# Altium project GEN3_FanCtrl_PROD_V03.PrjPcb (part 2 of 3)

## Sheet MCU.SchDoc
size A2; SheetNumber: 3; SheetTotal: 9; SPICEModelCacheXJMQHWHR: <root> / <DocumentId>XJMQHWHR</DocumentId> / </root>
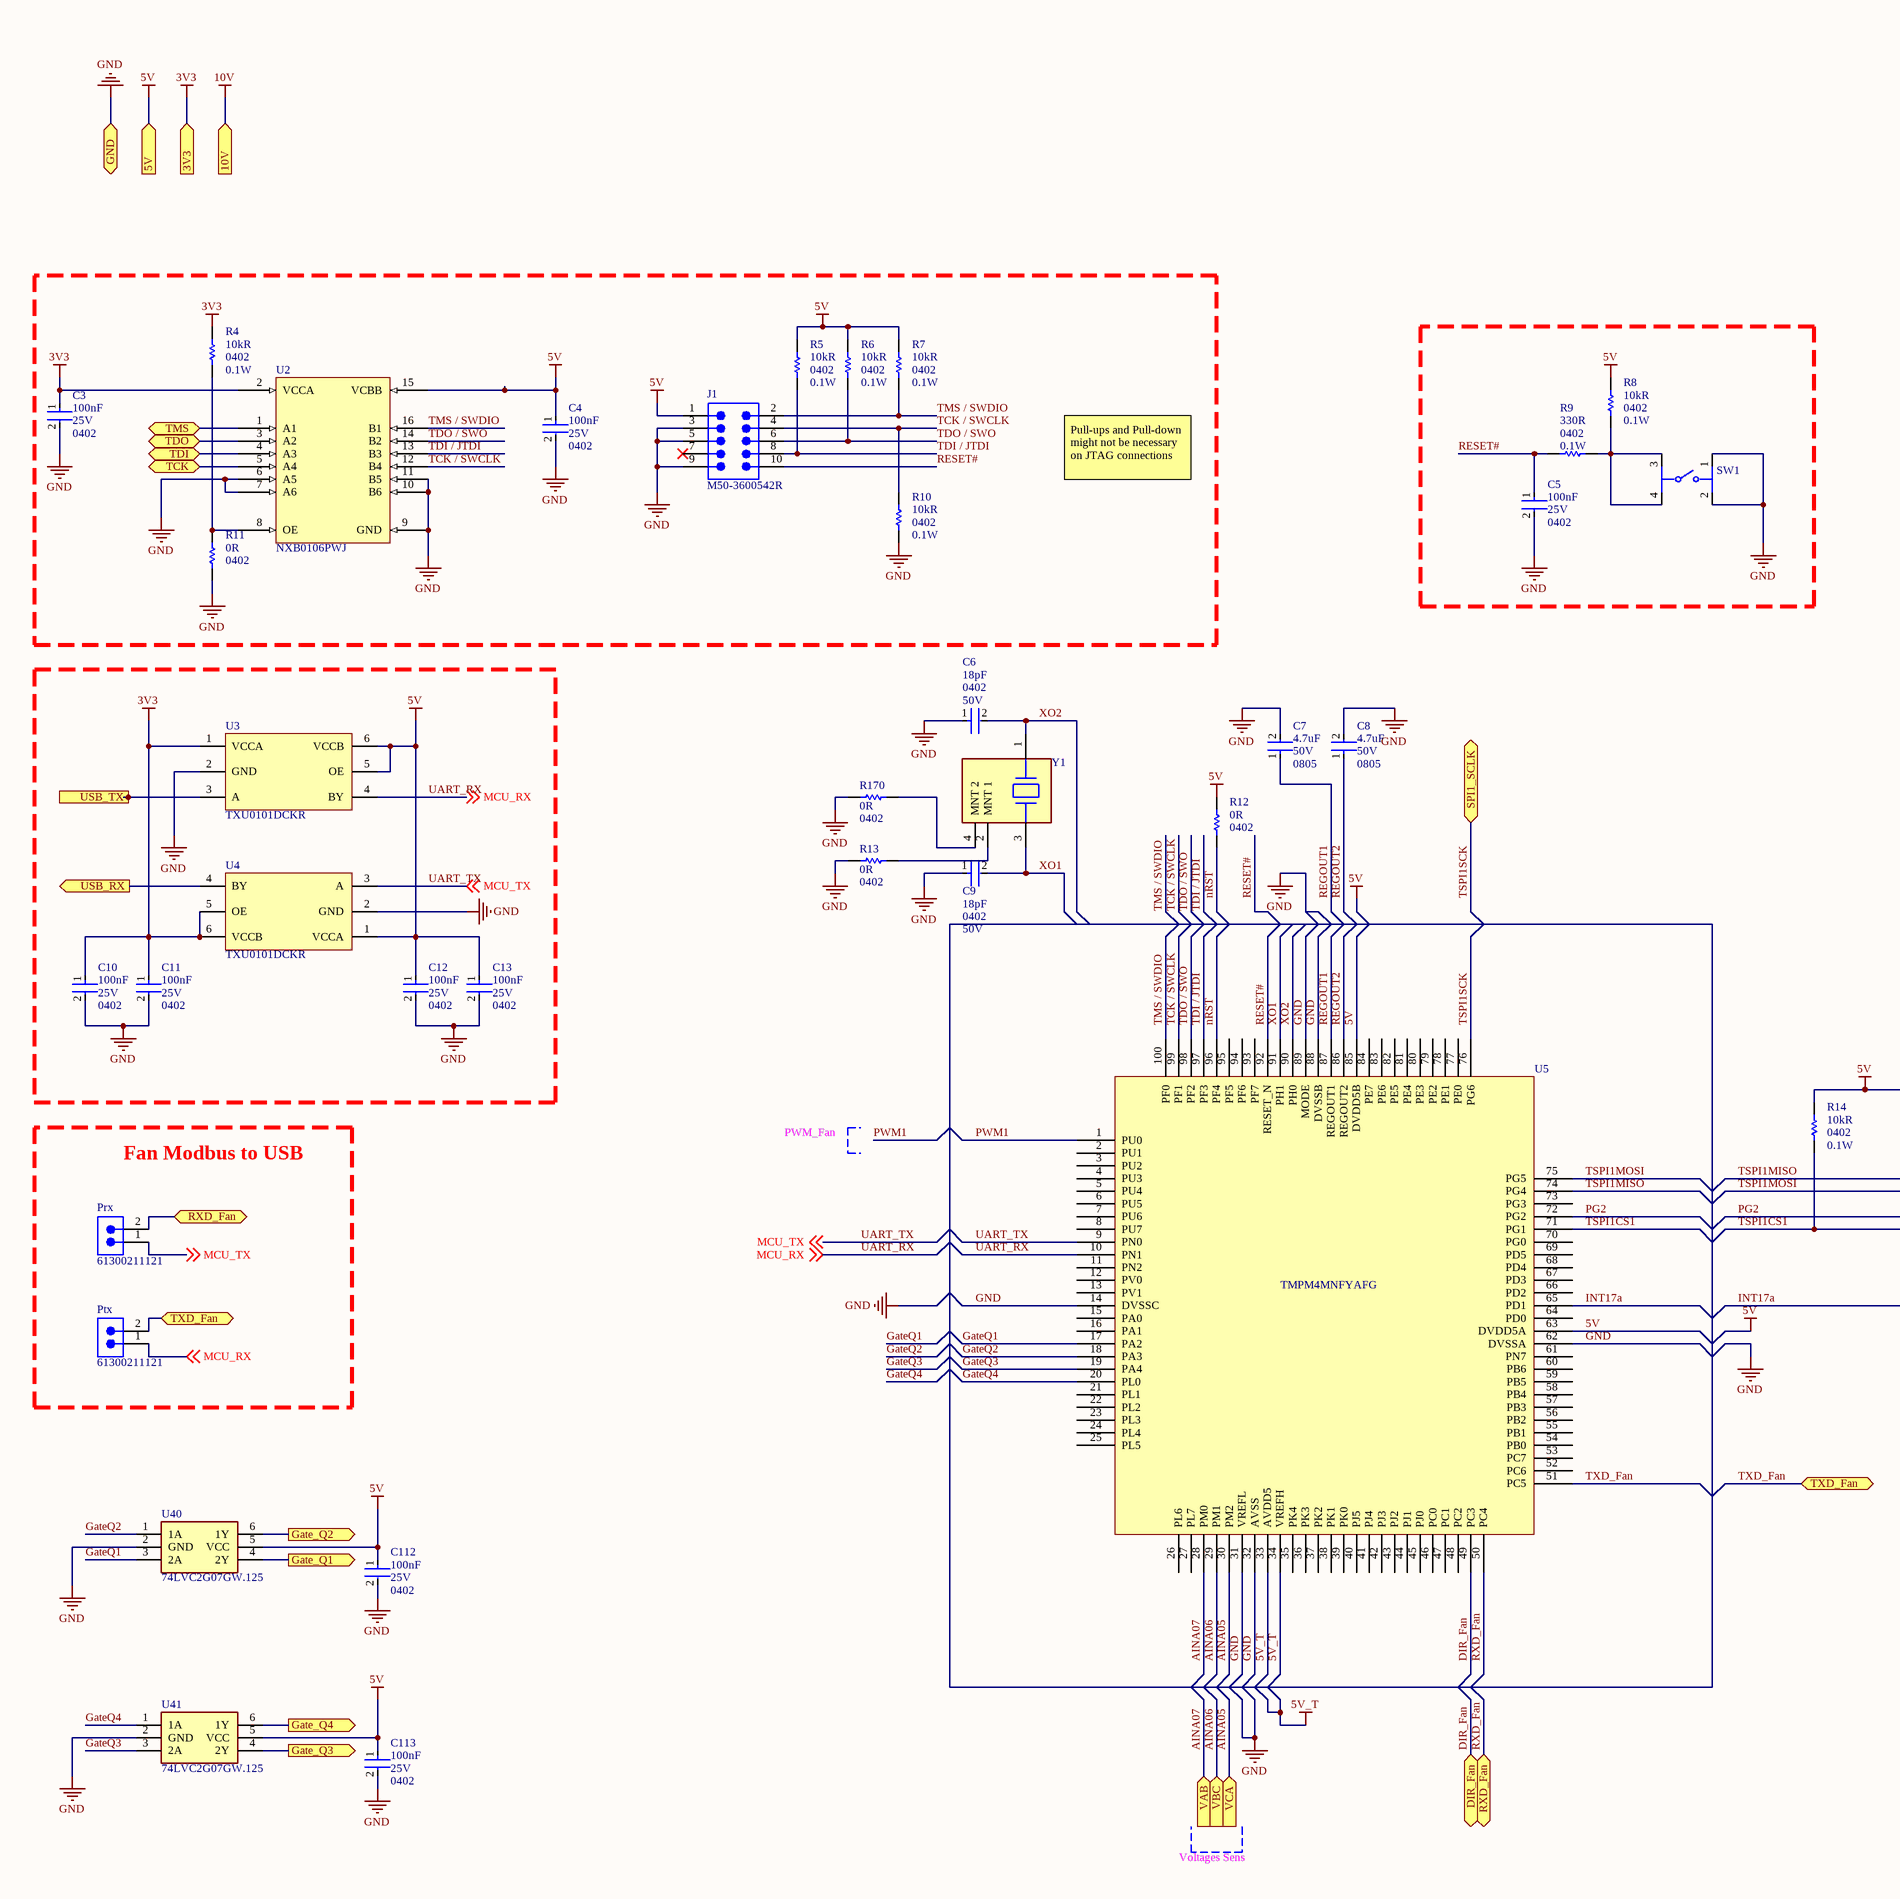
[diagram p5: MCU.SchDoc, left]
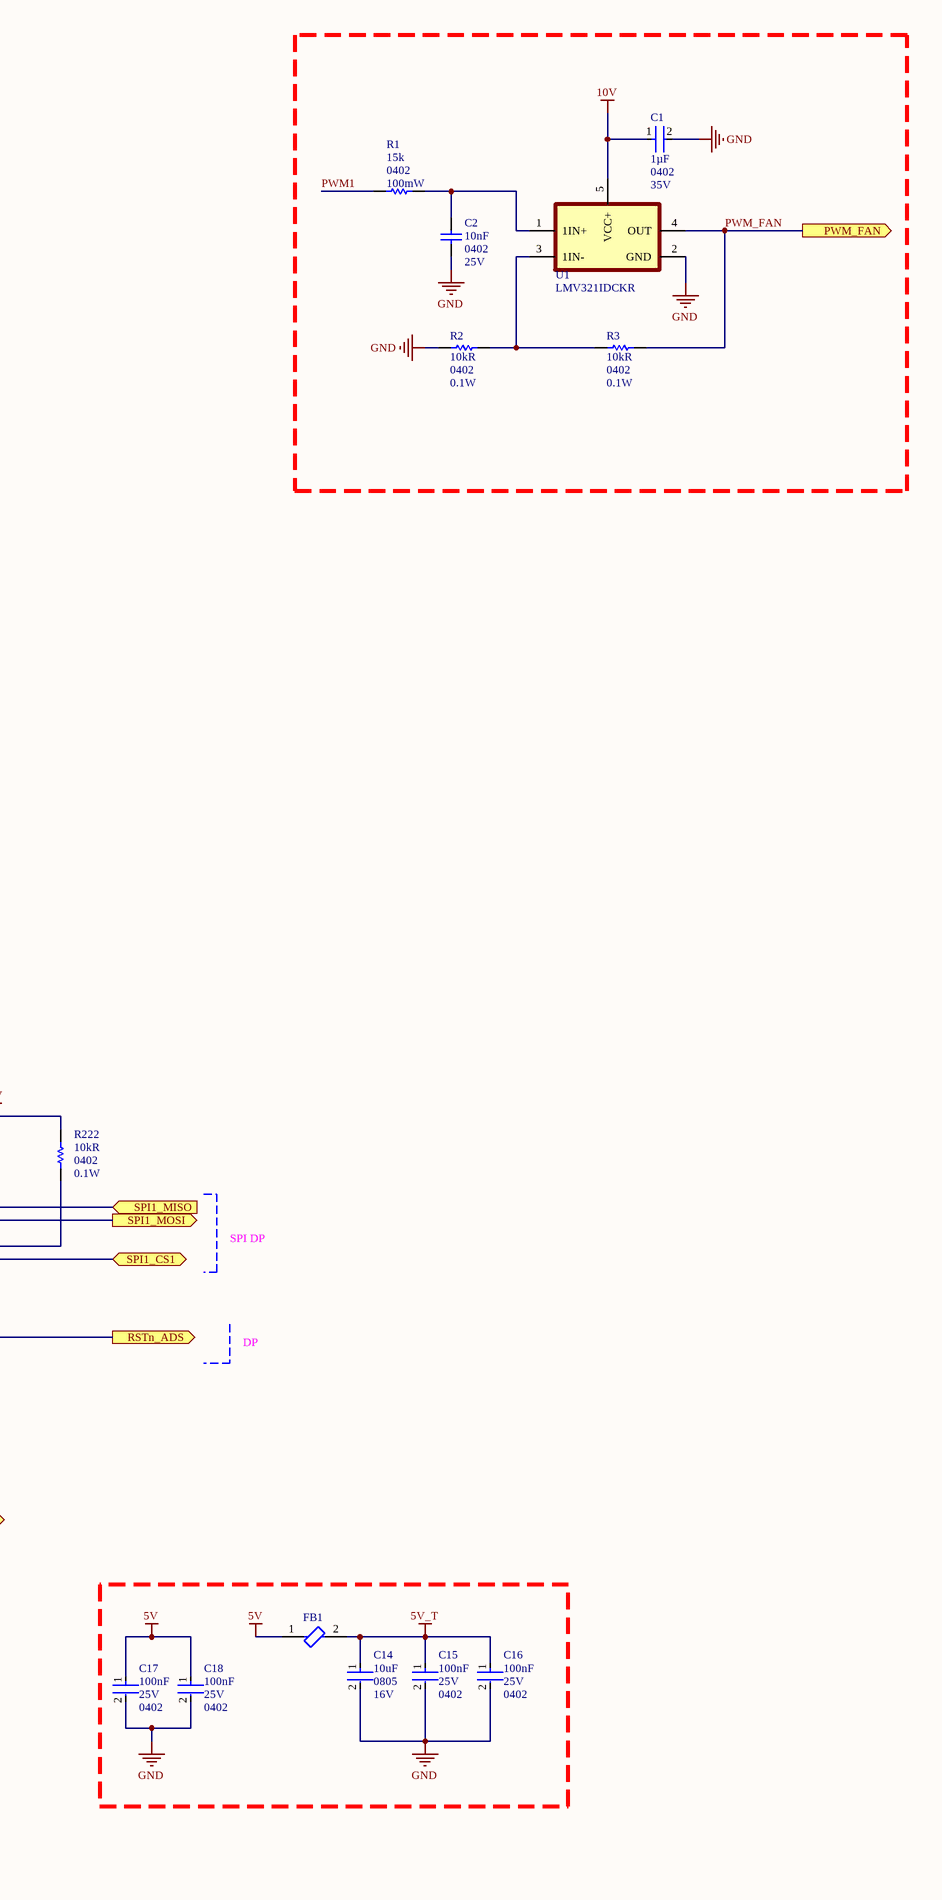
[diagram p6: MCU.SchDoc, right]

### Parts
C1  value 1µF  Case/Package: 0402  Voltage Rating: 35V  [FP-C1005-050-0_05-IPC_A]  (hidden comment: C1005JB1V105K050BC)
C2  value 10nF  Package: 0402  Parameter 1: 25V  [CAPC1005X55X25ML05T10]  (hidden comment: GRM155R71E103KA01D)
C3  value 100nF  Voltage Rating: 25V  Case/Package: 0402  [FP-CL830-IPC_A]  (hidden comment: CL05B104KA5NNNC)
C4  value 100nF  Voltage Rating: 25V  Case/Package: 0402  [FP-CL830-IPC_A]  (hidden comment: CL05B104KA5NNNC)
C5  value 100nF  Voltage Rating: 25V  Case/Package: 0402  [FP-CL830-IPC_A]  (hidden comment: CL05B104KA5NNNC)
C6  value 18pF  Case/Package: 0402  Voltage Rating: 50V  [FP-GJM155-0_05-IPC_A]  (hidden comment: GJM1555C1H180GB01D)
C7  Case/Package: 0805  Capacitance: 4.7uF  Voltage Rating: 50V  [FP-GRM21B-0_15-IPC_B]  (hidden comment: GRM21BR61H475KE51L)
C8  Case/Package: 0805  Capacitance: 4.7uF  Voltage Rating: 50V  [FP-GRM21B-0_15-IPC_B]  (hidden comment: GRM21BR61H475KE51L)
C9  value 18pF  Case/Package: 0402  Voltage Rating: 50V  [FP-GJM155-0_05-IPC_A]  (hidden comment: GJM1555C1H180GB01D)
C10  value 100nF  Voltage Rating: 25V  Case/Package: 0402  [FP-CL830-IPC_A]  (hidden comment: CL05B104KA5NNNC)
C11  value 100nF  Voltage Rating: 25V  Case/Package: 0402  [FP-CL830-IPC_A]  (hidden comment: CL05B104KA5NNNC)
C12  value 100nF  Voltage Rating: 25V  Case/Package: 0402  [FP-CL830-IPC_A]  (hidden comment: CL05B104KA5NNNC)
C13  value 100nF  Voltage Rating: 25V  Case/Package: 0402  [FP-CL830-IPC_A]  (hidden comment: CL05B104KA5NNNC)
C14  Case Code (Imperial): 0805  Voltage Rating: 16V  Capacitance: 10uF  [FP-GRM21B-0_1-MFG]  (hidden comment: GRM21BR61C106KE15K)
C15  value 100nF  Voltage Rating: 25V  Case/Package: 0402  [FP-CL830-IPC_A]  (hidden comment: CL05B104KA5NNNC)
C16  value 100nF  Voltage Rating: 25V  Case/Package: 0402  [FP-CL830-IPC_A]  (hidden comment: CL05B104KA5NNNC)
C17  value 100nF  Voltage Rating: 25V  Case/Package: 0402  [FP-CL830-IPC_A]  (hidden comment: CL05B104KA5NNNC)
C18  value 100nF  Voltage Rating: 25V  Case/Package: 0402  [FP-CL830-IPC_A]  (hidden comment: CL05B104KA5NNNC)
C112  value 100nF  Voltage Rating: 25V  Case/Package: 0402  [FP-CL830-IPC_A]  (hidden comment: CL05B104KA5NNNC)
C113  value 100nF  Voltage Rating: 25V  Case/Package: 0402  [FP-CL830-IPC_A]  (hidden comment: CL05B104KA5NNNC)
FB1  MPZ2012S221AT000  [FP-MPZ2012-MFG]  (value not drawn)
J1  M50-3600542R  [FP-M50-3600542R-MFG]
Prx  61300211121  [61300211121]
Ptx  61300211121  [61300211121]
R1  value 15k  Case/Package: 0402  Power: 100mW  [RESC1005X40X25LL10T10]  (hidden comment: RK73H1ETTP1502F)
R2  value 10kR  Package: 0402  Power: 0.1W  [RESC1005X40X25LL10T10]  (hidden comment: RK73H1ETTP1002F)
R3  value 10kR  Package: 0402  Power: 0.1W  [RESC1005X40X25LL10T10]  (hidden comment: RK73H1ETTP1002F)
R4  value 10kR  Package: 0402  Power Rating: 0.1W  [RESC1005X40X25LL10T10]  (hidden comment: RK73H1ETTP1002F)
R5  value 10kR  Package: 0402  Power Rating: 0.1W  [RESC1005X40X25LL10T10]  (hidden comment: RK73H1ETTP1002F)
R6  value 10kR  Package: 0402  Power Rating: 0.1W  [RESC1005X40X25LL10T10]  (hidden comment: RK73H1ETTP1002F)
R7  value 10kR  Package: 0402  Power Rating: 0.1W  [RESC1005X40X25LL10T10]  (hidden comment: RK73H1ETTP1002F)
R8  value 10kR  Package: 0402  Power Rating: 0.1W  [RESC1005X40X25LL10T10]  (hidden comment: RK73H1ETTP1002F)
R9  value 330R  Package: 0402  Power Rating: 0.1W  [RESC1005X40X25LL10T10]  (hidden comment: RK73H1ETTP3300F)
R10  value 10kR  Package: 0402  Power Rating: 0.1W  [RESC1005X40X25LL10T10]  (hidden comment: RK73H1ETTP1002F)
R11  value 0R  Package: 0402  [FP-RK73Z1E-IPC_B]  (hidden comment: RK73Z1ETTP)
R12  value 0R  Package: 0402  [FP-RK73Z1E-IPC_B]  (hidden comment: RK73Z1ETTP)
R13  value 0R  Package: 0402  [FP-RK73Z1E-IPC_B]  (hidden comment: RK73Z1ETTP)
R14  value 10kR  Package: 0402  Power Rating: 0.1W  [RESC1005X40X25LL10T10]  (hidden comment: RK73H1ETTP1002F)
R170  value 0R  Package: 0402  [FP-RK73Z1E-IPC_B]  (hidden comment: RK73Z1ETTP)
R222  value 10kR  Package: 0402  Power Rating: 0.1W  [RESC1005X40X25LL10T10]  (hidden comment: RK73H1ETTP1002F)
SW1  PTS810SJM250SMTRLFS  [FP-PTS810SJM250SMTRLFS-MFG]  (value not drawn)
U1  LMV321IDCKR  [LMV321IDCKR-Footprint-1]
U2  NXB0106PWJ  [TSOP65P640X120-16N]
U3  TXU0101DCKR  [FP-DCK0006A-MFG]
U4  TXU0101DCKR  [FP-DCK0006A-MFG]
U5  TMPM4MNFYAFG  [TSQFP50P1600X1600X145-100N]  (value not drawn)
U40  74LVC2G07GW.125  [74LVC2G07GW.125-Footprint-1]
U41  74LVC2G07GW.125  [74LVC2G07GW.125-Footprint-1]
Y1  ABM10-166-12.000MHZ-T3  [FP-ABM10-166-167-MFG]  (value not drawn)

### Blocks framed on the sheet
Fan Modbus to USB: Prx Ptx

### Ports
3V3 (in), 5V (in), 10V (in), DIR_Fan (bidir), Gate_Q1 (out), Gate_Q2 (out), Gate_Q3 (out), Gate_Q4 (out), GND (bidir), PWM_FAN (out), RSTn_ADS (out), RXD_Fan (bidir), SPI1_CS1 (bidir), SPI1_MISO (in), SPI1_MOSI (out), SPI1_SCLK (bidir), TCK (bidir), TDI (bidir), TDO (bidir), TMS (bidir), TXD_Fan (bidir), USB_RX (out), USB_TX (in), VAB (in), VBC (in), VCA (in)

### Nets
3V3: C3.1 C10.1 C11.1 R4.2 U2.2(VCCA) U3.1(VCCA) U4.5(OE) U4.6(VCCB) ; port 3V3
5V: C4.1 C12.1 C13.1 C17.1 C18.1 C112.1 C113.1 FB1.1 J1.1 R5.2 R6.2 R7.2 R8.2 R12.2 R14.2 R222.2 U2.15(VCBB) U3.5(OE) U3.6(VCCB) U4.1(VCCA) U5.63(DVDD5A) U5.85(DVDD5B) U40.5(VCC) U41.5(VCC) ; port 5V
5V_T: C14.1 C15.1 C16.1 FB1.2 U5.33(AVDD5) U5.34(VREFH)
10V: C1.1 U1.5(VCC+) ; port 10V
GND: C1.2 C2.1 C3.2 C4.2 C5.2 C6.1 C7.2 C8.2 C9.1 C10.2 C11.2 C12.2 C13.2 C14.2 C15.2 C16.2 C17.2 C18.2 C112.2 C113.2 J1.3 J1.5 J1.9 R2.1 R10.1 R11.1 R13.2 R170.2 SW1.1 SW1.2 U1.2(GND) U2.6(A5) U2.7(A6) U2.9(GND) U2.10(B6) U2.11(B5) U3.2(GND) U4.2(GND) U5.14(DVSSC) U5.31(VREFL) U5.32(AVSS) U5.62(DVSSA) U5.88(DVSSB) U5.89(MODE) U40.2(GND) U41.2(GND) ; port GND
AINA05: U5.30(PM2) ; port VCA
AINA06: U5.29(PM1) ; port VBC
AINA07: U5.28(PM0) ; port VAB
DIR_Fan: U5.49(PC3) ; port DIR_Fan
Gate_Q1: U40.4(2Y) ; port Gate_Q1
Gate_Q2: U40.6(1Y) ; port Gate_Q2
Gate_Q3: U41.4(2Y) ; port Gate_Q3
Gate_Q4: U41.6(1Y) ; port Gate_Q4
GateQ1: U5.17(PA2) U40.3(2A)
GateQ2: U5.18(PA3) U40.1(1A)
GateQ3: U5.19(PA4) U41.3(2A)
GateQ4: U5.20(PL0) U41.1(1A)
INT17a: U5.65(PD1) ; port RSTn_ADS
nRST: R12.1 U5.96(PF4)
PG2: R222.1 U5.72(PG2)
PWM1: R1.1 U5.1(PU0)
PWM_FAN: R3.2 U1.4(OUT) ; port PWM_FAN
REGOUT1: C7.1 U5.87(REGOUT1)
REGOUT2: C8.1 U5.86(REGOUT2)
RESET#: C5.1 J1.10 R9.1 U5.92(RESET_N)
RXD_Fan: Prx.2 U5.50(PC4) ; port RXD_Fan
TCK: U2.5(A4) ; port TCK
TCK / SWCLK: J1.4 R10.2 U2.12(B4) U5.99(PF1)
TDI: U2.4(A3) ; port TDI
TDI / JTDI: J1.8 R5.1 U2.13(B3) U5.97(PF3)
TDO: U2.3(A2) ; port TDO
TDO / SWO: J1.6 R6.1 U2.14(B2) U5.98(PF2)
TMS: U2.1(A1) ; port TMS
TMS / SWDIO: J1.2 R7.1 U2.16(B1) U5.100(PF0)
TSPI1CS1: R14.1 U5.71(PG1) ; port SPI1_CS1  [project net ~{C}S]
TSPI1MISO: U5.74(PG4) ; port SPI1_MISO  [project net MISO]
TSPI1MOSI: U5.75(PG5) ; port SPI1_MOSI  [project net MOSI]
TSPI1SCK: U5.76(PG6) ; port SPI1_SCLK  [project net SCLK]
TXD_Fan: Ptx.2 U5.51(PC5) ; port TXD_Fan
UART_RX: Ptx.1 U3.4(BY) U5.10(PN1) ; off-sheet MCU_RX  [also labelled MCU_RX]
UART_TX: Prx.1 U4.3(A) U5.9(PN0) ; off-sheet MCU_TX  [also labelled MCU_TX]
USB_RX: U4.4(BY) ; port USB_RX
USB_TX: U3.3(A) ; port USB_TX
XO1: C9.2 U5.91(PH1) Y1.3
XO2: C6.2 U5.90(PH0) Y1.1
NetC2_2: C2.2 R1.2 U1.1(1IN+)
NetR2_2: R2.2 R3.1 U1.3(1IN-)
NetR4_1: R4.1 R11.2 U2.8(OE)
NetR8_1: R8.1 R9.2 SW1.3 SW1.4
NetR13_1: R13.1 Y1.2(MNT_1)
NetR170_1: R170.1 Y1.4(MNT_2)

Not connected (* = marked no-connect by the designer): J1 7*; U5 2(PU1) 3(PU2) 4(PU3) 5(PU4) 6(PU5) 7(PU6) 8(PU7) 11(PN2) 12(PV0) 13(PV1) 15(PA0) 16(PA1) 21(PL1) 22(PL2) 23(PL3) 24(PL4) 25(PL5) 26(PL6) 27(PL7) 35(PK4) 36(PK3) 37(PK2) 38(PK1) 39(PK0) 40(PJ5) 41(PJ4) 42(PJ3) 43(PJ2) 44(PJ1) 45(PJ0) 46(PC0) 47(PC1) 48(PC2) 52(PC6) 53(PC7) 54(PB0) 55(PB1) 56(PB2) 57(PB3) 58(PB4) 59(PB5) 60(PB6) 61(PN7) 64(PD0) 66(PD2) 67(PD3) 68(PD4) 69(PD5) 70(PG0) 73(PG3) 77(PE0) 78(PE1) 79(PE2) 80(PE3) 81(PE4) 82(PE5) 83(PE6) 84(PE7) 93(PF7) 94(PF6) 95(PF5)

### Notes on the sheet
- Pull-ups and Pull-down might not be necessary on JTAG connections
- PWM_Fan
- SPI DP
- DP
- Voltages Sens
- Title:
- Date:
- Drawn By:
- File:
- Time:
- Checked By:
- Sheet
- of

### Library data of the parts
C1 = CMP-001-00329-1: Ceramic Capacitor, Multilayer, Ceramic, 35V, 10% +Tol, 10% -Tol, JB, 10% TC, 1uF, Surface Mount, 0402; Capacitor Type: Ceramic; Min Operating Temperature: -25°C; RoHS Compliant: Yes; Max Operating Temperature: 85°C; Pins: 2; Mounting Technology: Surface Mount
C2 = CMP-x00072-1: Ceramic Capacitor, Multilayer, Ceramic, 25V, 10% +Tol, 10% -Tol, X7R, 15% TC, 0.01uF, Surface Mount, 0402; Manufacturer: Murata; Template: MR_0402; Vendor: TTI; Reel Width: 8mm; Mounting: SMT; MOQ: 10000; Category: Capacitor; Price: 0.00352
C3-C5 C10-C13 C15-C18 C112 C113 = CMP-001-00333-1: Ceramic Capacitor, Multilayer, Ceramic, 25V, 10% +Tol, 10% -Tol, X7R, 15% TC, 0.1uF, Surface Mount, 0402; Max Operating Temperature: 125°C; RoHS Compliant: Yes; Capacitor Type: Ceramic; Min Operating Temperature: -55°C; Pins: 2; Mounting Technology: Surface Mount
C6 C9 = CMP-001-00347-1: Ceramic Capacitor, Multilayer, Ceramic, 50V, 2% +Tol, 2% -Tol, C0G, 30ppm/Cel TC, 0.000018uF, Surface Mount, 0402; Max Operating Temperature: 125°C; RoHS Compliant: Yes; Pins: 2; Capacitor Type: Ceramic; Min Operating Temperature: -55°C; Mounting Technology: Surface Mount
C7 C8 = CMP-06035-059131-1: Chip Multilayer Ceramic Capacitors for General Purpose, 0805, 4.7uF, X5R, 15%, 10%, 50V; Case Code (Metric): 2012; Height: 1.25mm; Width: 0.049inch; Packaging: Tape and Reel; Mount: Surface Mount; REACH SVHC: No SVHC; Case Code (Imperial): 0805; Dielectric: X5R; Thickness: 0.055inch; Material: Ceramic; Depth: 1.25mm; Min Operating Temperature: -55°C; Lead Free: Lead Free; Max Operating Temperature: 85°C; Tolerance: 10%; Length: 2mm; Voltage Rating (DC): 50V
C14 = CMP-2007-03534-2: Chip Multilayer Ceramic Capacitors for General Purpose, 0805, 10uF, X5R, 15%, 10%, 16V; Packaging: Tape and Reel; Width: 0.049inch; Depth: 1.25mm; Height: 1.25mm; Case/Package: 0805; Max Operating Temperature: 85°C; Min Operating Temperature: -55°C; Tolerance: 10%; Dielectric: X5R; REACH SVHC: No SVHC; Mount: Surface Mount; Radiation Hardening: No; Case Code (Metric): 2012; Length: 2mm; Package Quantity: 10000; Voltage Rating (DC): 16V; Voltage: 16V; Thickness: 0.053inch; Termination: SMD/SMT
FB1 = CMP-08257-000020-1: FERRITE BEAD 220 OHM 0805 1LN; Test Frequency: 100MHz; Max DC Current: 3A; Tolerance: 25%; Impedance: 220R; DC Resistance (DCR): 40mR; Case/Package: 0805; Mount: Surface Mount; Termination: SMD/SMT; Packaging: Tape and Reel; Core Material: Ferrite; Case Code (Metric): 2012; Length: 0.079inch; Width: 0.049inch; Case Code (Imperial): 0805; REACH SVHC: No SVHC; Weight: 0.000194oz; Current Rating: 3A; Min Operating Temperature: -55°C; Lead Free: Lead Free; Package Quantity: 4000; Max Operating Temperature: 125°C; RoHS Compliant: Yes; Depth: 1.25mm; Height: 0.85mm
J1 = CMP-002-00657-2: Board Connector, 10 Contact(s), 2 Row(s), Female, Straight, 0.05 inch Pitch, Surface Mount Terminal, Locking, Black Insulator, Socket; Rating: 1A; Vendor: TTI; Reel Size: 16mm; MOQ: 800; Price Floor Quantity: 8000; Max Operating Temperature: 105°C; Mounting: SMT; Min Operating Temperature: -40°C; Source: Components - 07.02.25 - 13.24.SchLib; Mounting Technology: Board; Connector Type: BOARD CONNECTOR; RoHS Compliant: Yes; Price Floor: 0.75; Design Item ID: CMP-00130-1; Price @ MOQ: 0.86; Category: Connector; Case/Package: [5 x 2] 1.27mm
Prx Ptx = CMP-002-00257-1: WR-PHD Pin Header, THT, Vertical, pitch 2.54mm, 1 Row, 2P; Manufacturer: Wurth Elektronik; Contact Resistance: 20mOhm; Working Voltage: 250V; Rated Current: 3A; Withstanding Voltage: 500V; Match Code: WR-PHD; Packaging: Bag; ComponentLink2Description: Datasheet Link; Source: WR-PHD.SchLib; Operating Temperature Max: 105°C; Pin Count: 2; Orientation: Vertical; Gender: Pin Header; Pitch: 2.54mm; Manufacturer Part Number: 61300211121; Mount: Through Hole; ComponentLink1Description: Website Link; ComponentLink2URL: https://www.we-online.com/redexpert/spec/61300211121?ad; Pins: 2; ComponentLink1URL: https://www.we-online.com/redexpert/article/61300211121?ad; Design Item ID: 61300211121; Category: Board-to-Board Connectors; Number of Rows: 1; Component Type: Standard; Operating Temperature Min: -40°C
R1 = CMP-009-01023-1: Fixed Resistor, Metal Glaze/thick Film, 0.1W, 15000ohm, 75V, 1% +/-Tol, 100ppm/Cel, Surface Mount, 0402; Max Operating Temperature: 155°C; Tolerance: 1%; Min Operating Temperature: -55°C; Pins: 2; RoHS Compliant: Yes; Mounting Technology: Surface Mount
R2-R8 R10 R14 R222 = CMP-x00150-2: Fixed Resistor, Metal Glaze/thick Film, 0.1W, 10000ohm, 75V, 1% +/-Tol, 100ppm/Cel, Surface Mount, 0402; Template: KS_0402_R
R9 = CMP-x00168-1: Fixed Resistor, Metal Glaze/thick Film, 0.1W, 330ohm, 75V, 1% +/-Tol, 100ppm/Cel, Surface Mount, 0402
R11-R13 R170 = CMP-x00147-2: Metal Glaze/thick Film, 0ohm, Surface Mount, 0402; Template: KS_0402_R
  R11 R12: Power Rating: *
SW1 = CMP-x00082-1: Keypad Switch, 1 Switches, SPST, Momentary-tactile, 0.05A, 16VDC, 1.57N, Solder Terminal, Surface Mount-straight; Manufacturer: C&K; Reel Width: 12mm; Vendor: TTI; Category: Switches; MOQ: 2900; Mounting: SMT; Package: SPST; Price: 0.233; Template: -; Value: -
U1 = CMP-014-00033-1: Operational Amplifier, 1 Func, 7000uV Offset-Max, BIPolar, PDSO5; Channels: 1; Nominal Supply Voltage: 2.7V; Pins: 5; RoHS Compliant: Yes; Min Operating Temperature: -40°C; Case/Package: TSSOP; Max Operating Temperature: 125°C
U2 = CMP-x00220-1: NXB0106 - Dual supply translating transceiver; auto direction sensing; 3-state
U3 U4 = CMP-x00221-3: Single channel fixed-direction level shifter 6-SC70 -40 to 125
U5 = CMP-001-0044-8: Toshiba Micro
U40 U41 = CMP-00122-1: Buffer, Non-Inverting 2 Element 1 Bit per Element Open Drain Output 6-TSSOP
Y1 = CMP-003-00032-4: Crystal 12MHz ±10ppm (Tol) ±10ppm (Stability) 8pF FUND 125Ohm 4-Pin SMD T/R; Manufacturer: TI; Vendor: TTI; Reel Size: 8mm; Template: TI_4_SMD; Category: Crystal; Price: 0.207; Rating: 8pF; MOQ: 3000; Value: 12MHz; Package: 4-SMD; Mounting Technology: SMT

## Sheet USB.SchDoc
size A3; SheetNumber: 2; SheetTotal: 9
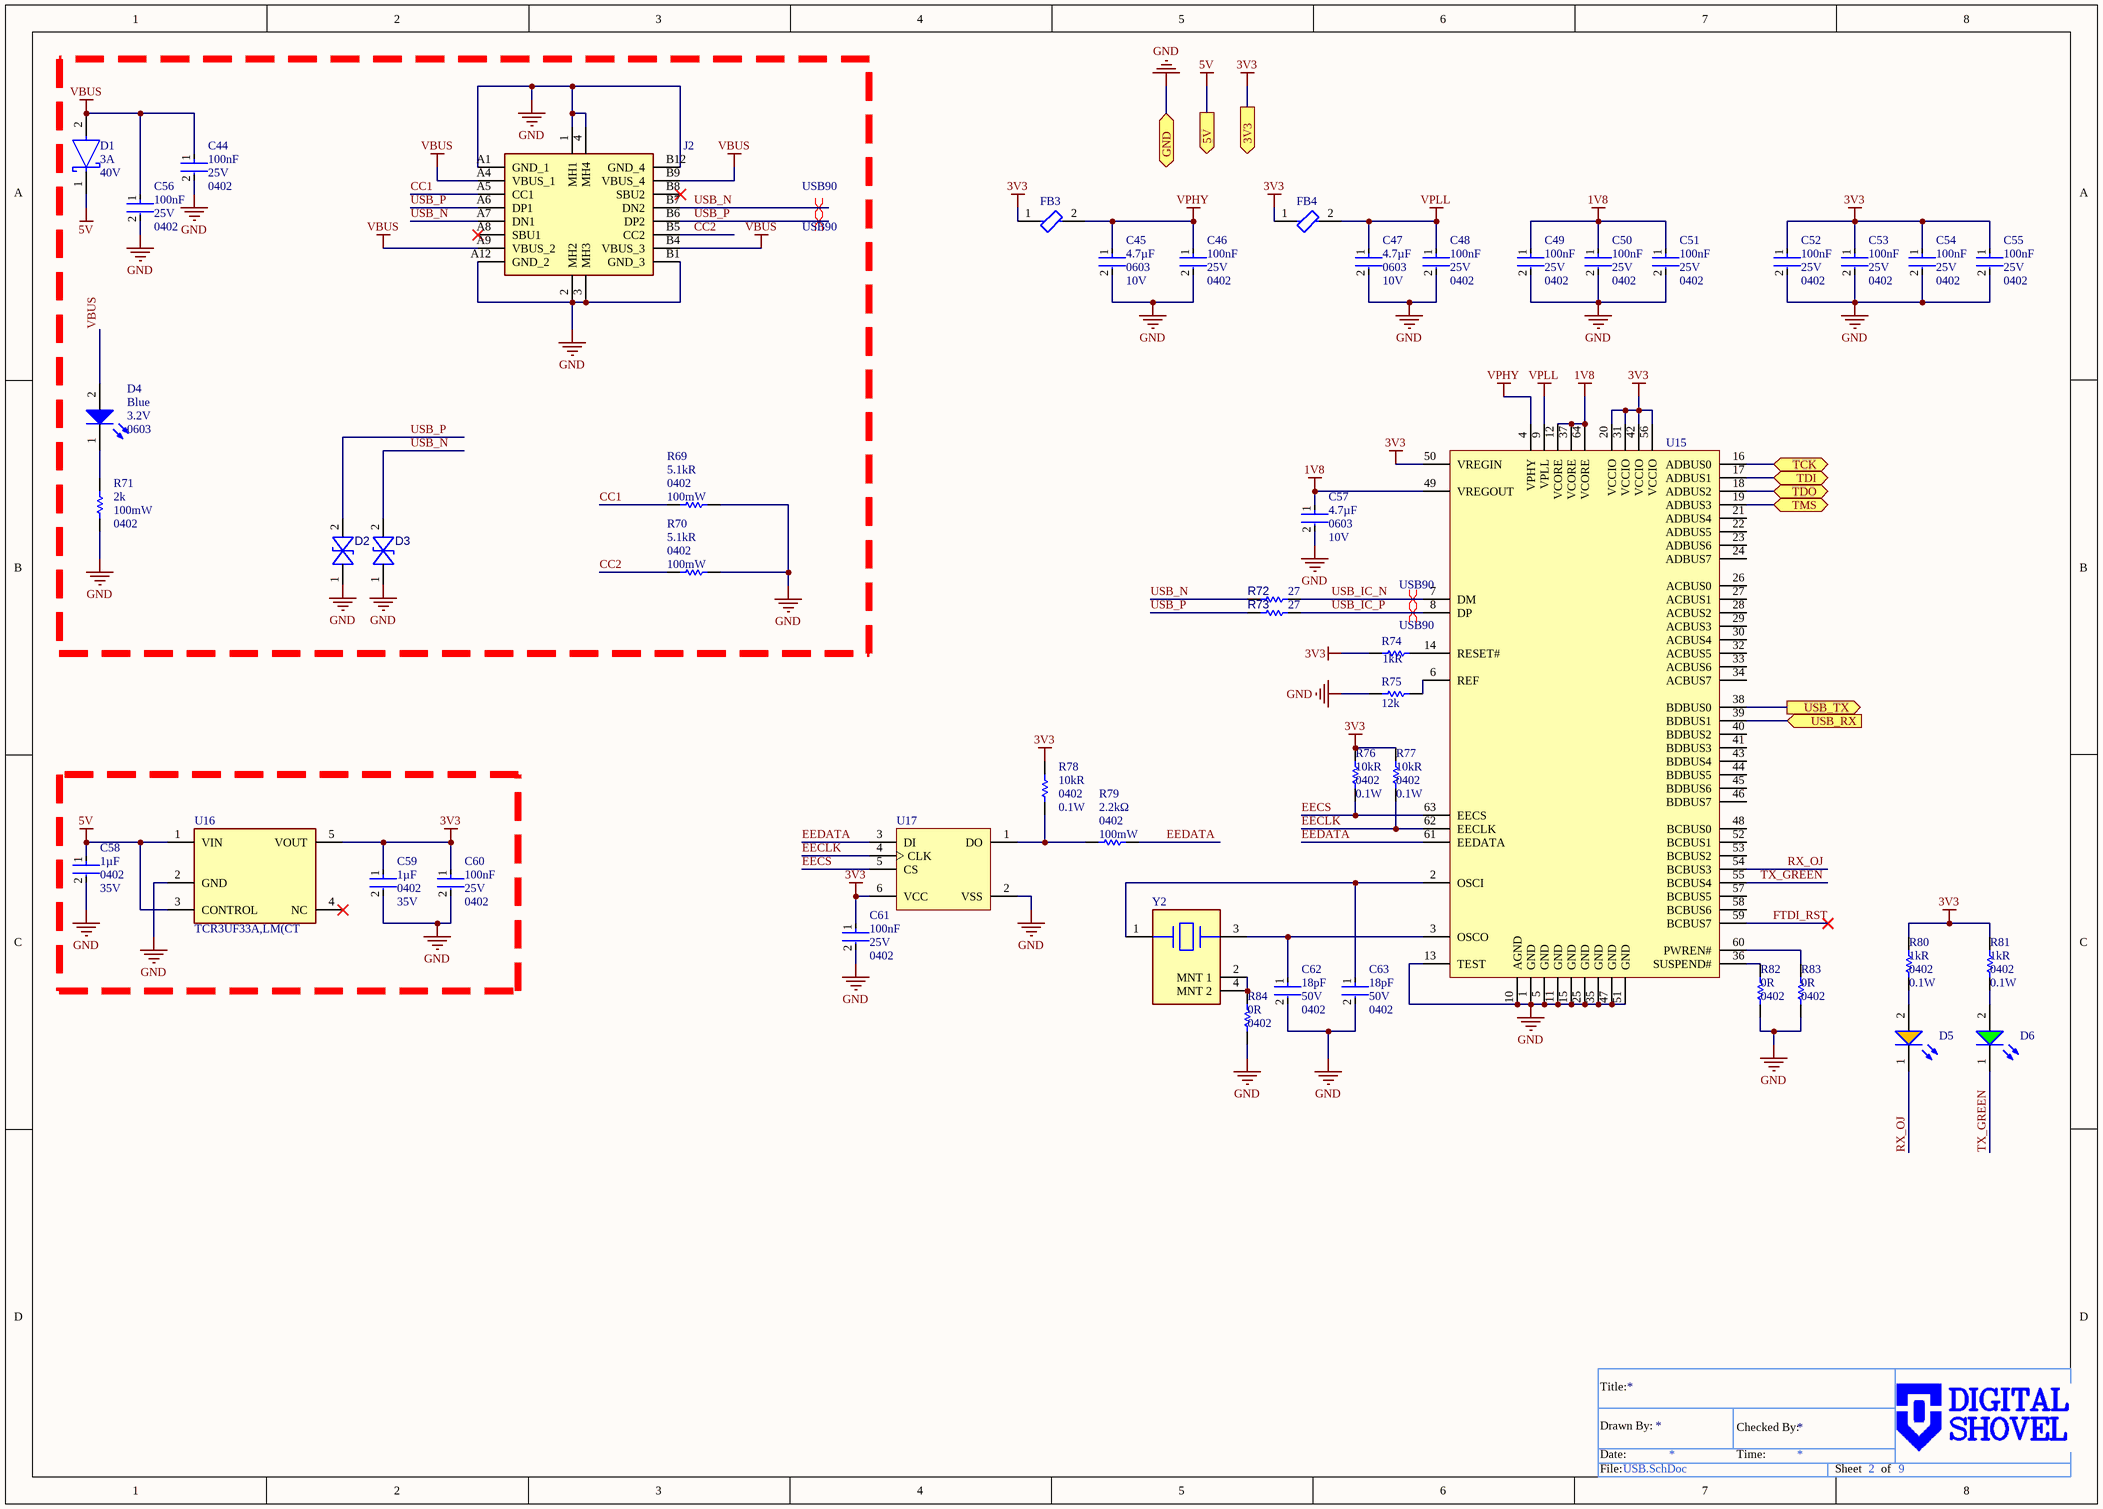
[diagram p7: USB.SchDoc]

### Parts
C44  value 100nF  Voltage Rating: 25V  Case/Package: 0402  [FP-CL830-IPC_A]  (hidden comment: CL05B104KA5NNNC)
C45  value 4.7µF  Case/Package: 0603  Voltage Rating: 10V  [FP-CL10-IPC_A]  (hidden comment: CL10A475KP8NNNC)
C46  value 100nF  Voltage Rating: 25V  Case/Package: 0402  [FP-CL830-IPC_A]  (hidden comment: CL05B104KA5NNNC)
C47  value 4.7µF  Case/Package: 0603  Voltage Rating: 10V  [FP-CL10-IPC_A]  (hidden comment: CL10A475KP8NNNC)
C48  value 100nF  Voltage Rating: 25V  Case/Package: 0402  [FP-CL830-IPC_A]  (hidden comment: CL05B104KA5NNNC)
C49  value 100nF  Voltage Rating: 25V  Case/Package: 0402  [FP-CL830-IPC_A]  (hidden comment: CL05B104KA5NNNC)
C50  value 100nF  Voltage Rating: 25V  Case/Package: 0402  [FP-CL830-IPC_A]  (hidden comment: CL05B104KA5NNNC)
C51  value 100nF  Voltage Rating: 25V  Case/Package: 0402  [FP-CL830-IPC_A]  (hidden comment: CL05B104KA5NNNC)
C52  value 100nF  Voltage Rating: 25V  Case/Package: 0402  [FP-CL830-IPC_A]  (hidden comment: CL05B104KA5NNNC)
C53  value 100nF  Voltage Rating: 25V  Case/Package: 0402  [FP-CL830-IPC_A]  (hidden comment: CL05B104KA5NNNC)
C54  value 100nF  Voltage Rating: 25V  Case/Package: 0402  [FP-CL830-IPC_A]  (hidden comment: CL05B104KA5NNNC)
C55  value 100nF  Voltage Rating: 25V  Case/Package: 0402  [FP-CL830-IPC_A]  (hidden comment: CL05B104KA5NNNC)
C56  value 100nF  Voltage Rating: 25V  Case/Package: 0402  [FP-CL830-IPC_A]  (hidden comment: CL05B104KA5NNNC)
C57  value 4.7µF  Case/Package: 0603  Voltage Rating: 10V  [FP-CL10-IPC_A]  (hidden comment: CL10A475KP8NNNC)
C58  value 1µF  Case/Package: 0402  Voltage Rating: 35V  [FP-C1005-050-0_05-IPC_A]  (hidden comment: C1005JB1V105K050BC)
C59  value 1µF  Case/Package: 0402  Voltage Rating: 35V  [FP-C1005-050-0_05-IPC_A]  (hidden comment: C1005JB1V105K050BC)
C60  value 100nF  Voltage Rating: 25V  Case/Package: 0402  [FP-CL830-IPC_A]  (hidden comment: CL05B104KA5NNNC)
C61  value 100nF  Voltage Rating: 25V  Case/Package: 0402  [FP-CL830-IPC_A]  (hidden comment: CL05B104KA5NNNC)
C62  value 18pF  Case/Package: 0402  Voltage Rating: 50V  [FP-GJM155-0_05-IPC_A]  (hidden comment: GJM1555C1H180GB01D)
C63  value 18pF  Case/Package: 0402  Voltage Rating: 50V  [FP-GJM155-0_05-IPC_A]  (hidden comment: GJM1555C1H180GB01D)
D1  value 3A  Voltage Rating: 40V  [FP-SOD123W-MFG]  (hidden comment: PMEG3020ER,115)
D2  TPD1E01B04DPYR  [TPD1E01B04DPYR-Footprint-1]  (value not drawn)
D3  TPD1E01B04DPYR  [TPD1E01B04DPYR-Footprint-1]  (value not drawn)
D4  Forward Voltage: 3.2V  Case/Package: 0603  Colour: Blue  [WL-SMCW_0603_150060xx75000]  (hidden comment: 150060BS75000)
D5  150060AS75000  [WL-SMCW_0603_150060xx75000]  (value not drawn)
D6  150060VS75000  [WL-SMCW_0603_150060xx75000]  (value not drawn)
FB3  BLM21PG300SN1D  [FP-BLM21-0_2-t0_85-e0_5-d-MFG]  (value not drawn)
FB4  BLM21PG300SN1D  [FP-BLM21-0_2-t0_85-e0_5-d-MFG]  (value not drawn)
J2  USB4145-03-0170-C  [GCT_USB4145-03-0170-C_REVA2]  (value not drawn)
R69  value 5.1kR  Package: 0402  Power: 100mW  [RESC1005X40X25LL10T10]  (hidden comment: RK73H1ETTP5101F)
R70  value 5.1kR  Package: 0402  Power: 100mW  [RESC1005X40X25LL10T10]  (hidden comment: RK73H1ETTP5101F)
R71  value 2k  Case/Package: 0402  Power: 100mW  [RESC1005X40X25LL10T10]  (hidden comment: RK73H1ETTP2001F)
R72  value 27  [RK73H1ETTP27R0F-Footprint-1]  (hidden comment: RK73H1ETTP27R0F)
R73  value 27  [RK73H1ETTP27R0F-Footprint-1]  (hidden comment: RK73H1ETTP27R0F)
R74  value 1kR  [RESC1005X40X25LL10T10]  (hidden comment: RK73H1ETTP1001F)
R75  value 12k  [RESC1005X40X25LL10T10]  (hidden comment: RK73H1ETTP1202F)
R76  value 10kR  Package: 0402  Power: 0.1W  [RESC1005X40X25LL10T10]  (hidden comment: RK73H1ETTP1002F)
R77  value 10kR  Package: 0402  Power: 0.1W  [RESC1005X40X25LL10T10]  (hidden comment: RK73H1ETTP1002F)
R78  value 10kR  Package: 0402  Power Rating: 0.1W  [RESC1005X40X25LL10T10]  (hidden comment: RK73H1ETTP1002F)
R79  value 2.2kΩ  Package: 0402  Rating: 100mW  [RK73H1ETTP2201F-Footprint-1]  (hidden comment: RK73H1ETTP2201F)
R80  value 1kR  Package: 0402  Power: 0.1W  [RESC1005X40X25LL10T10]  (hidden comment: RK73H1ETTP1001F)
R81  value 1kR  Package: 0402  Power: 0.1W  [RESC1005X40X25LL10T10]  (hidden comment: RK73H1ETTP1001F)
R82  value 0R  Package: 0402  [FP-RK73Z1E-IPC_B]  (hidden comment: RK73Z1ETTP)
R83  value 0R  Package: 0402  [FP-RK73Z1E-IPC_B]  (hidden comment: RK73Z1ETTP)
R84  value 0R  Package: 0402  [FP-RK73Z1E-IPC_B]  (hidden comment: RK73Z1ETTP)
U15  FT2232HL-REEL  [LQFP-64_M]  (value not drawn)
U16  TCR3UF33A,LM(CT  [TCR3UF33A,LM(CT-Footprint-1]
U17  93LC46BT-I/OT  [SOT-23-OT6_M]  (value not drawn)
Y2  ABM10-166-12.000MHZ-T3  [FP-ABM10-166-167-MFG]  (value not drawn)

### Ports
3V3 (out), 5V (out), GND (bidir), TCK (bidir), TDI (bidir), TDO (bidir), TMS (bidir), USB_RX (in), USB_TX (out)

### Nets
1V8: C49.1 C50.1 C51.1 C57.1 U15.12(VCORE) U15.37(VCORE) U15.49(VREGOUT) U15.64(VCORE)
3V3: C52.1 C53.1 C54.1 C55.1 C59.1 C60.1 C61.1 FB3.1 FB4.1 R74.1 R76.2 R77.2 R78.2 R80.2 R81.2 U15.20(VCCIO) U15.31(VCCIO) U15.42(VCCIO) U15.50(VREGIN) U15.56(VCCIO) U16.5(VOUT) U17.6(VCC) ; port 3V3
5V: C58.1 D1.1(C) U16.1(VIN) U16.3(CONTROL) ; port 5V
GND: C44.2 C45.2 C46.2 C47.2 C48.2 C49.2 C50.2 C51.2 C52.2 C53.2 C54.2 C55.2 C56.2 C57.2 C58.2 C59.2 C60.2 C61.2 C62.2 C63.2 D2.1 D3.1 J2.1(MH1) J2.2(MH2) J2.3(MH3) J2.4(MH4) J2.A1(GND_1) J2.A12(GND_2) J2.B1(GND_3) J2.B12(GND_4) R69.2 R70.2 R71.1 R75.1 R82.1 R83.1 R84.1 U15.1(GND) U15.5(GND) U15.10(AGND) U15.11(GND) U15.13(TEST) U15.15(GND) U15.25(GND) U15.35(GND) U15.47(GND) U15.51(GND) U16.2(GND) U17.2(VSS) ; port GND
VBUS: C44.1 C56.1 D1.2(A) D4.2(A) J2.A4(VBUS_1) J2.A9(VBUS_2) J2.B4(VBUS_3) J2.B9(VBUS_4)
VPHY: C45.1 C46.1 FB3.2 U15.4(VPHY)
VPLL: C47.1 C48.1 FB4.2 U15.9(VPLL)
CC1: J2.A5(CC1) R69.1
CC2: J2.B5(CC2) R70.1
EECLK: R77.1 U15.62(EECLK) U17.4(CLK)
EECS: R76.1 U15.63(EECS) U17.5(CS)
EEDATA: R79.2 U15.61(EEDATA) U17.3(DI)
FTDI_RST: U15.59(BCBUS7)
RX_OJ: D5.1(K) U15.54(BCBUS3)
TCK: U15.16(ADBUS0) ; port TCK
TDI: U15.17(ADBUS1) ; port TDI
TDO: U15.18(ADBUS2) ; port TDO
TMS: U15.19(ADBUS3) ; port TMS
TX_GREEN: D6.1(K) U15.55(BCBUS4)
USB_IC_N: R72.2 U15.7(DM)
USB_IC_P: R73.2 U15.8(DP)
USB_N: D3.2 J2.A7(DN1) J2.B7(DN2) R72.1
USB_P: D2.2 J2.A6(DP1) J2.B6(DP2) R73.1
USB_RX: U15.39(BDBUS1) ; port USB_RX
USB_TX: U15.38(BDBUS0) ; port USB_TX
NetC62_1: C62.1 U15.3(OSCO) Y2.3
NetC63_1: C63.1 U15.2(OSCI) Y2.1
NetD4_1: D4.1(K) R71.2
NetD5_2: D5.2(A) R80.1
NetD6_2: D6.2(A) R81.1
NetR74_2: R74.2 U15.14(RESET#)
NetR75_2: R75.2 U15.6(REF)
NetR78_1: R78.1 R79.1 U17.1(DO)
NetR82_2: R82.2 U15.36(SUSPEND#)
NetR83_2: R83.2 U15.60(PWREN#)
NetR84_2: R84.2 Y2.2(MNT_1) Y2.4(MNT_2)

Not connected (* = marked no-connect by the designer): J2 A8(SBU1)* B8(SBU2)*; U15 21(ADBUS4) 22(ADBUS5) 23(ADBUS6) 24(ADBUS7) 26(ACBUS0) 27(ACBUS1) 28(ACBUS2) 29(ACBUS3) 30(ACBUS4) 32(ACBUS5) 33(ACBUS6) 34(ACBUS7) 40(BDBUS2) 41(BDBUS3) 43(BDBUS4) 44(BDBUS5) 45(BDBUS6) 46(BDBUS7) 48(BCBUS0) 52(BCBUS1) 53(BCBUS2) 57(BCBUS5) 58(BCBUS6); U16 4(NC)*

### Layout directives
differential pair; differential pair class USB90: USB_IC_N, USB_IC_P, USB_N, USB_P

### Notes on the sheet
- Title:
- Date:
- Drawn By:
- Time:
- Checked By:
- File:
- Sheet
- of

### Library data of the parts
C44 C46 C48-C56 C60 C61 = CMP-001-00333-1: as C3-C5 on sheet MCU; Max Operating Temperature: 125°C; RoHS Compliant: Yes; Capacitor Type: Ceramic; Min Operating Temperature: -55°C; Pins: 2; Mounting Technology: Surface Mount
C45 C47 C57 = CMP-001-00331-1: Ceramic Capacitor, Multilayer, Ceramic, 10V, 10% +Tol, 10% -Tol, X5R, 15% TC, 4.7uF, Surface Mount, 0603; Capacitor Type: Ceramic; RoHS Compliant: Yes; Pins: 2; Mounting Technology: Surface Mount; Max Operating Temperature: 85°C; Min Operating Temperature: -55°C
C58 C59 = CMP-001-00329-1: as C1 on sheet MCU; Capacitor Type: Ceramic; Min Operating Temperature: -25°C; RoHS Compliant: Yes; Max Operating Temperature: 85°C; Pins: 2; Mounting Technology: Surface Mount
C62 C63 = CMP-001-00347-1: as C6 on sheet MCU; Max Operating Temperature: 125°C; RoHS Compliant: Yes; Pins: 2; Capacitor Type: Ceramic; Min Operating Temperature: -55°C; Mounting Technology: Surface Mount
D1 = CMP-x00083-1: Rectifier Diode, Schottky, 1 Phase, 1 Element, 3A, 40V V(RRM), Silicon; Manufacturer: Nexperia; Reel Width: 8mm; Template: NX_SOD_123W_2; Vendor: TTI; Category: Diodes; MOQ: 3000; Mounting: SMT; Package: SOD-123W-2; Price: 0.072
D2 D3 = CMP-004-00089-1: Trans Voltage Suppressor Diode, 27W, 3.6V V(RWM), Bidirectional, 1 Element, Silicon; RoHS Compliant: Yes
D4 = CMP-007-00049-1: Single Color LED, Blue, Water Clear, 1.1mm; Forward Current: 30mA; Pins: 2; Min Operating Temperature: -40°C; Max Operating Temperature: 85°C; Mounting Technology: Surface Mount; RoHS Compliant: Yes
D5 = CMP-007-00053-1: Single Color LED, Amber, Water Clear, 1.1mm; RoHS Compliant: Yes
D6 = CMP-007-00054-1: Single Color LED, Bright Green, Water Clear, 1.1mm; Forward Current: 30mA; Max Operating Temperature: 85°C; Pins: 2; RoHS Compliant: Yes; Mounting Technology: Surface Mount; Min Operating Temperature: -40°C
FB3 FB4 = CMP-0686-00620-3: Chip Ferrite Bead, 0805, 30Ω @ 100MHz, 0.014Ω, , 4A; Tolerance: 25%; Number of Circuits: 1; Impedance: 30R; Max DC Current: 3A; Shielding: Unshielded; Material: Steel; Resistance: 15mR; DC Resistance-Max: 14mR; Series: BLM21P; Military Standard: Not; Max Current Rating: 4A; Termination: SMD/SMT; Length: 2mm; Width: 1.25mm; Test Frequency: 100MHz; Packaging: Tape and Reel; Case/Package: 0805; Current Rating: 4A; Depth: 1.25mm; Package Quantity: 1; REACH SVHC: No SVHC; Core Material: Ferrite; Max Operating Temperature: 125°C; DC Current: 3A; Height: 0.85mm; Frequency: 100MHz; Number of Lines: 1; Case Code (Metric): 2012; Min Operating Temperature: -55°C; Radiation Hardening: No; Case Code (Imperial): 0805; Number of Pins: 2; RoHS Compliant: Yes; DC Resistance (DCR): 14mR; Lead Free: Lead Free
J2 = CMP-349-000000-01-A-3: USB Connectors USB-C Rec 3u Vert 16P SMT 1.7mm TH stakes H7.46mm T+R+Cap; MP: USB4145-03-0170-C_REVA2; Value: *; Availability: Unavailable; Pin Count: 20; Price: None; Package: None; Source: USB4145-03-0170-C_REVA2.SchLib; Design Item ID: USB4145-03-0170-C_REVA2; Component Type: Standard
R69 R70 = CMP-x00200-1: Fixed Resistor, Metal Glaze/thick Film, 0.1W, 5100ohm, 75V, 1% +/-Tol, 100ppm/Cel, Surface Mount, 0402; Manufacturer: KOA Speer; Template: KS_0402_R; Mounting: SMD; Category: Resistors
R71 = CMP-009-01011-1: Fixed Resistor, Metal Glaze/thick Film, 0.1W, 2000ohm, 75V, 1% +/-Tol, 100ppm/Cel, Surface Mount, 0402; Min Operating Temperature: -55°C; Pins: 2; Max Operating Temperature: 155°C; Tolerance: 1%; RoHS Compliant: Yes; Mounting Technology: Surface Mount
R72 R73 = CMP-009-01029-1: Fixed Resistor, Metal Glaze/thick Film, 0.1W, 27ohm, 75V, 1% +/-Tol, 100ppm/Cel, Surface Mount, 0402; Power: 100mW; Max Operating Temperature: 155°C; Tolerance: 1%; Case/Package: 0402; Pins: 2; RoHS Compliant: Yes; Min Operating Temperature: -55°C; Mounting Technology: Surface Mount
R74 R80 R81 = CMP-x00163-2: Fixed Resistor, Metal Glaze/thick Film, 0.1W, 1000ohm, 75V, 1% +/-Tol, 100ppm/Cel, Surface Mount, 0402; Manufacturer: KOA Speer; Template: KS_0402_R; Category: Resistors
R75 = CMP-009-01014-1: Fixed Resistor, Metal Glaze/thick Film, 0.1W, 12000ohm, 75V, 1% +/-Tol, 100ppm/Cel, Surface Mount, 0402; Power: 100mW; Max Operating Temperature: 155°C; Min Operating Temperature: -55°C; RoHS Compliant: Yes; Tolerance: 1%; Case/Package: 0402; Pins: 2; Mounting Technology: Surface Mount
R76-R78 = CMP-x00150-2: as R2-R8 on sheet MCU
R79 = CMP-x00008-4: Fixed Resistor, Metal Glaze/thick Film, 0.1W, 2200ohm, 75V, 1% +/-Tol, 100ppm/Cel, Surface Mount, 0402; Manufacturer: KOA Speer; Vendor: TTI; Reel Width: 8mm; Template: KS_0402_R; MOQ: 10000; Price: 0.00297; Category: Resistor; Mounting: SMT
R82-R84 = CMP-x00147-2: as R11-R13 on sheet MCU
U15 = CMP-x00055-5: USB Bus Controller, CMOS, PQFP64; Manufacturer: FTDI; Value: 3 - 5.25V; Template: FT_LQPF_64; Vendor: Mouser; MOQ: 1000; Price: 6.26; Mounting: SMD; Package: LQFP-64; Category: IC
U16 = CMP-x00051-5: (ldo) Linear Voltage Reg, Vin: 6; Manufacturer: Toshiba; Value: 5.5V; Template: TS_SOT_25; Vendor: TTI; Reel Width: 8mm; Mounting: SMT; Package: SOT-25; Price: 0.108; MOQ: 3000; Category: IC
U17 = CMP-x00087-2: EEPROM, 64X16, Serial, CMOS, PDSO6; Manufacturer: Microchip Technology; Reel Width: 8mm; Template: MT_SOT_23_6; Vendor: Microchip Direct; Category: IC; MOQ: 30000; Mounting: SMT; Package: SOT-23-6
Y2 = CMP-003-00032-4: as Y1 on sheet MCU; Category: Crystal; Price: 0.207; Rating: 8pF; MOQ: 3000; Value: 12MHz; Package: 4-SMD; Mounting Technology: SMT

## Sheet ModBus.SchDoc
size A4; SPICEModelCacheNTQUVIAM: <root> / <DocumentId>NTQUVIAM</DocumentId> / <CacheFrame Number="0"> / <Model Name="tmk107b7105_a-t" Kind="CKT"> / <Text>* TMK107B7105_A-T     SPICE MODEL  ( General Type ) / *-------------------------------------------------------------------------------------------------------- / * Model Generated by TAIYO YUDEN Corporation (http://www.ty-top.com) / * Version 1.0 / * TAIYO YUDEN Control No. 170508_100817 / * Copyright(c) 2012 TAIYO YUDEN CO.,LTD. All Rights Reserved. / *-------------------------------------------------------------------------------------------------------- / * / * Products Name : Multilayer Ceramic Capacitors / * / * Characteristics : / *     Capacitance : 1 uF , Rated Voltage : 25V , TCC : X7R / *     Case Size : 1.6 x 0.8 / 0.063 x 0.031 [mm/inch] , Thickness : 0.8 / 0.031 [mm/inch] / *     (Conditions: Temperature = 25 degC , DC Bias Current/Voltage = 0A / 0V) / * / * Frequency Range : 40Hz - 3GHz / * / * External Node Assignments : / * / *  1  o---| |---o  2 / * / *-------------------------------------------------------------------------------------------------------- / .SubCkt TMK107B7105_A-T 1 2 / **************************** / C0 1 110 0.8077u / Cm 1 101 0.091409u / C1 101 102 0.22841u / Rc1 101 102 2.6849k / C2 102 103 0.056864u / Rc2 102 103 354.66 / C3 103 110 0.05273u / Rc3 103 110 25.631 / C2m 1 301 0.15309u / C21 301 302 0.37938u / Rc21 301 302 9.5172k / C22 302 303 0.45808u / Rc22 302 303 6.9429k / C23 303 304 0.40786u / Rc23 303 304 2.3301k / C24 304 305 0.15311u / Rc24 304 305 806.02 / C25 305 306 0.22413u / Rc25 305 306 462.56 / C26 306 307 0.18632u / Rc26 306 307 35.279 / C27 307 308 0.15722u / Rc27 307 308 39.531 / C28 308 309 0.078196u / Rc28 308 309 48.947 / C29 309 110 6560.8p / Rc29 309 110 9.5708 / Rp0 1 110 100Meg / L0 110 120 0.29644n / Lm 120 130 0.15558n / L1 120 121 0.202n / RL1 121 130 0.16398 / L2 120 122 0.33479n / RL2 122 130 0.31977 / L3 120 123 0.92343n / RL3 123 130 0.85069 / CR 120 124 0.21801u / LR 124 125 0.13885n / RR 125 130 35.905m / CL 130 140 1.934p / LL 130 140 0.19618n / RL 130 140 45.012 / Rs 140 2 6.428m / **************************** / .ends TMK107B7105_A-T</Text> / </Model> / </CacheFrame> / </root>; SheetNumber: 6; SheetTotal: 9
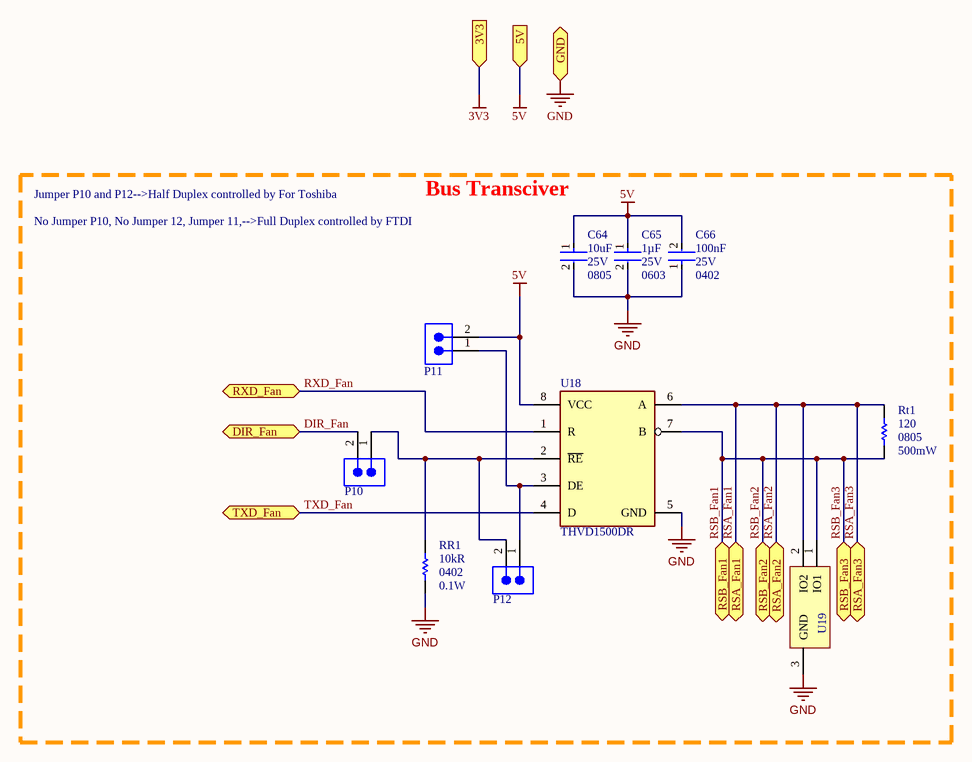
[diagram p8: ModBus.SchDoc]

### Parts
C64  value 10uF  Case/Package: 0805  Voltage Rating: 25V  [FP-CL21-IPC_B]  (hidden comment: CL21A106KAFN3NE)
C65  value 1µF  Voltage Rating: 25V  Case/Package: 0603  [FP-0603-L_1_6_0_1-W_0_8_0-IPC_A]  (hidden comment: TMK107B7105KA-T)
C66  value 100nF  Voltage Rating: 25V  Case/Package: 0402  [FP-CL830-IPC_A]  (hidden comment: CL05B104KA5NNNC)
P10  61300211121  [61300211121]  (value not drawn)
P11  61300211121  [61300211121]  (value not drawn)
P12  61300211121  [61300211121]  (value not drawn)
RR1  value 10kR  Package: 0402  Power Rating: 0.1W  [RESC1005X40X25LL10T10]  (hidden comment: RK73H1ETTP1002F)
Rt1  value 120  Power: 500mW  Case/Package: 0805  [RESC2013X70X40NL20T20]  (hidden comment: ERJ-P06J121V)
U18  THVD1500DR  [FP-D0008B-IPC_A]
U19  TPD2E007DCKR  [DCK0003A_M]  (value not drawn)

### Ports
3V3 (in), 5V (in), DIR_Fan (bidir), GND (bidir), RSA_Fan1 (bidir), RSA_Fan2 (bidir), RSA_Fan3 (bidir), RSB_Fan1 (bidir), RSB_Fan2 (bidir), RSB_Fan3 (bidir), RXD_Fan (bidir), TXD_Fan (bidir)

### Nets
5V: C64.1 C65.1 C66.2 P11.2 U18.8(VCC) ; port 5V
GND: C64.2 C65.2 C66.1 RR1.1 U18.5(GND) U19.3(GND) ; port GND
DIR_Fan: P10.2 ; port DIR_Fan
RSA_Fan1: Rt1.2 U18.6(A) U19.2(IO2) ; port RSA_Fan1, port RSA_Fan2, port RSA_Fan3  [also labelled RSA_Fan2, RSA_Fan3]
RSB_Fan1: Rt1.1 U18.7(B) U19.1(IO1) ; port RSB_Fan1, port RSB_Fan2, port RSB_Fan3  [also labelled RSB_Fan2, RSB_Fan3]
RXD_Fan: U18.1(R) ; port RXD_Fan
TXD_Fan: U18.4(D) ; port TXD_Fan
NetP10_1: P10.1 P12.2 RR1.2 U18.2(~{RE})
NetP11_1: P11.1 P12.1 U18.3(DE)

### Notes on the sheet
- Jumper P10 and P12-->Half Duplex controlled by For Toshiba
- Bus Transciver
- No Jumper P10, No Jumper 12, Jumper 11,-->Full Duplex controlled by FTDI
- Title:
- Date:
- Drawn By:
- Time:
- Checked By:
- File:
- Sheet
- of

### Library data of the parts
C64 = CMP-13271-000854-1: CL21 Series 0805 10uF 25V ±10% Tolerance X5R Multilayer Ceramic Chip Capacitor; Tolerance: 10%; Package Quantity: 1; Length: 0.079inch; Mount: Surface Mount; Thickness: 0.053inch; Width: 0.049inch; Min Operating Temperature: -55°C; Packaging: Cut Tape; Lead Free: Lead Free; Max Operating Temperature: 85°C; Case Code (Metric): 2012; Case Code (Imperial): 0805
C65 = CMP-001-00326-1: Ceramic Capacitor, Multilayer, Ceramic, 25V, 10% +Tol, 10% -Tol, X7R, 15% TC, 1uF, Surface Mount, 0603; Pins: 2; Capacitor Type: Ceramic; Min Operating Temperature: -55°C; Max Operating Temperature: 125°C; RoHS Compliant: Yes; Mounting Technology: Surface Mount
C66 = CMP-001-00333-1: as C3-C5 on sheet MCU; Max Operating Temperature: 125°C; RoHS Compliant: Yes; Capacitor Type: Ceramic; Min Operating Temperature: -55°C; Pins: 2; Mounting Technology: Surface Mount
P10-P12 = CMP-002-00257-1: as Prx on sheet MCU; Match Code: WR-PHD; Packaging: Bag; ComponentLink2Description: Datasheet Link; Source: WR-PHD.SchLib; Operating Temperature Max: 105°C; Pin Count: 2; Orientation: Vertical; Gender: Pin Header; Pitch: 2.54mm; Manufacturer Part Number: 61300211121; Mount: Through Hole; ComponentLink1Description: Website Link; ComponentLink2URL: https://www.we-online.com/redexpert/spec/61300211121?ad; Pins: 2; ComponentLink1URL: https://www.we-online.com/redexpert/article/61300211121?ad; Design Item ID: 61300211121; Category: Board-to-Board Connectors; Number of Rows: 1; Component Type: Standard; Operating Temperature Min: -40°C
RR1 = CMP-x00150-2: as R2-R8 on sheet MCU
Rt1 = CMP-009-01034-1: Fixed Resistor, Metal Glaze/thick Film, 0.5W, 120ohm, 400V, 5% +/-Tol, 200ppm/Cel, Surface Mount, 0805; Tolerance: 5%; Pins: 2; RoHS Compliant: Yes; Min Operating Temperature: -55°C; Max Operating Temperature: 155°C; Mounting Technology: Surface Mount
U18 = CMP-00111-1: Line Transceiver, 1 Func, 1 Driver, 1 Rcvr, PDSO8
U19 = CMP-004-00090-1: Trans Voltage Suppressor Diode, 13V V(RWM), Unidirectional, 4 Element, Silicon; Pins: 3; RoHS Compliant: Yes

## Sheet DP.SchDoc
size A3; SPICEModelCacheHOTVAOKI: <root> / <DocumentId>HOTVAOKI</DocumentId> / </root>; SheetNumber: 4; SheetTotal: 9
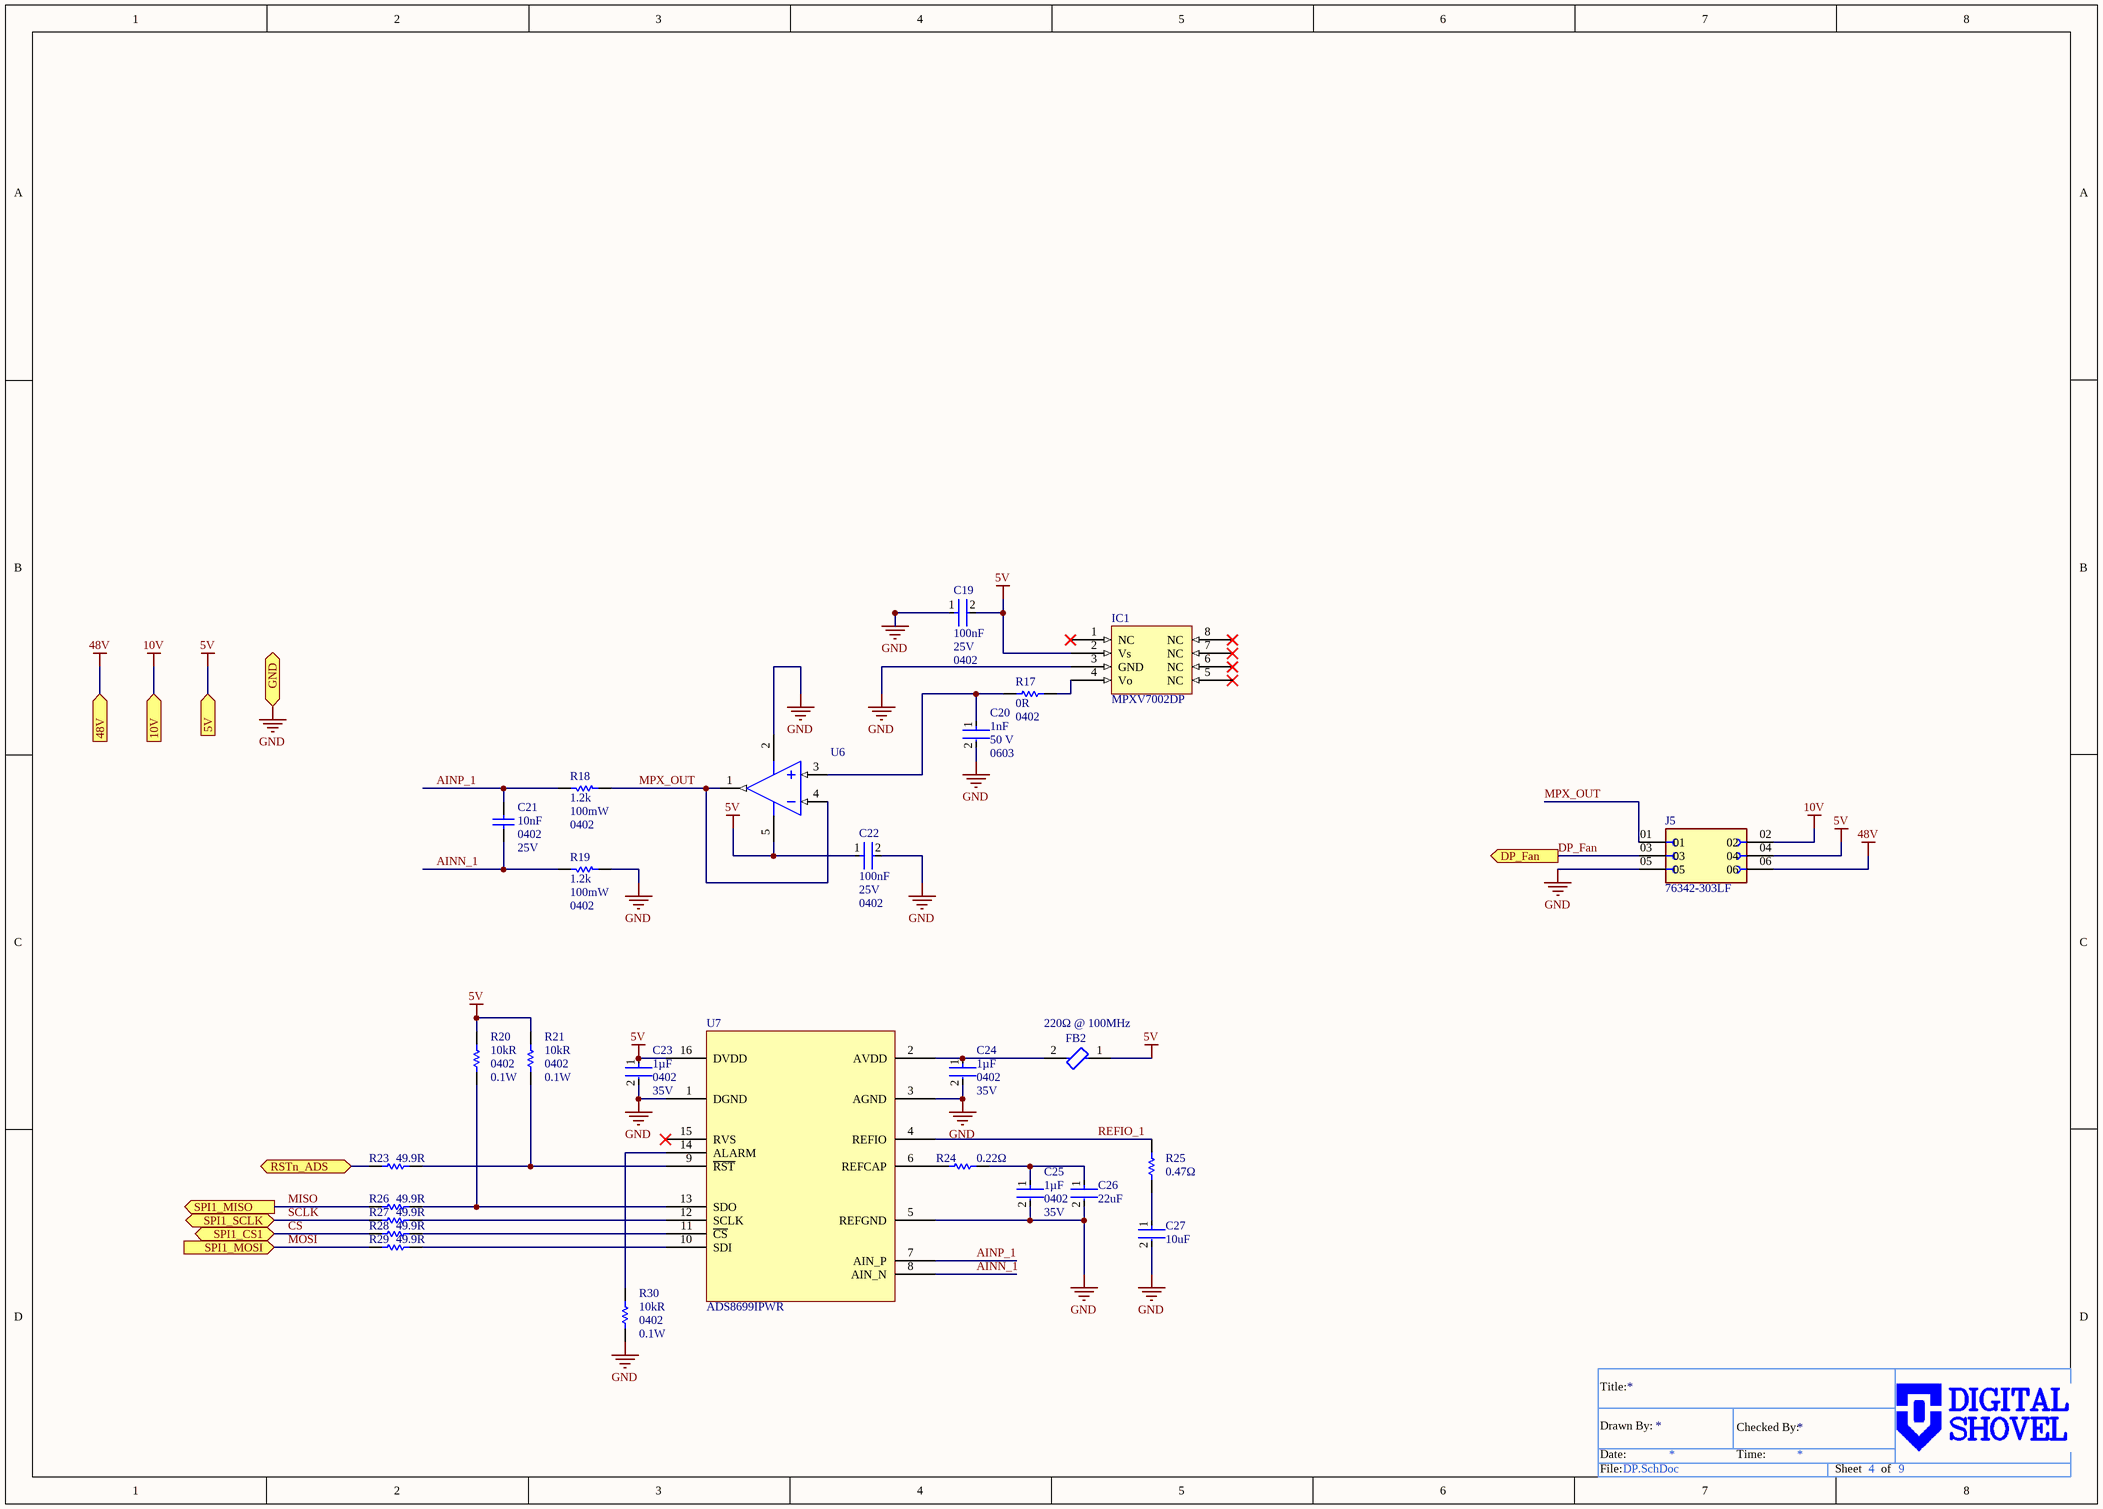
[diagram p9: DP.SchDoc]

### Parts
C19  value 100nF  Voltage Rating: 25V  Case/Package: 0402  [FP-CL830-IPC_A]  (hidden comment: CL05B104KA5NNNC)
C20  value 1nF  Voltage Rating: 50 V  Package: 0603  [FP-C0603C-CF-MFG]  (hidden comment: C0603C102K5RACTU)
C21  value 10nF  Package: 0402  Parameter 1: 25V  [CAPC1005X55X25ML05T10]  (hidden comment: GRM155R71E103KA01D)
C22  value 100nF  Voltage Rating: 25V  Case/Package: 0402  [FP-CL830-IPC_A]  (hidden comment: CL05B104KA5NNNC)
C23  value 1µF  Case/Package: 0402  Voltage Rating: 35V  [FP-C1005-050-0_05-IPC_A]  (hidden comment: C1005JB1V105K050BC)
C24  value 1µF  Case/Package: 0402  Voltage Rating: 35V  [FP-C1005-050-0_05-IPC_A]  (hidden comment: C1005JB1V105K050BC)
C25  value 1µF  Case/Package: 0402  Voltage Rating: 35V  [FP-C1005-050-0_05-IPC_A]  (hidden comment: C1005JB1V105K050BC)
C26  value 22uF  [FP-GRM21B-0_2-e0_2_0_7-IPC_A]  (hidden comment: GRM21BR61C226ME44L)
C27  value 10uF  [FP-CL21-IPC_B]  (hidden comment: CL21A106KAFN3NE)
FB2  value 220Ω @ 100MHz  [FP-BLM18-0_15-t0_8-IPC_C]  (hidden comment: BLM18KG221SN1D)
IC1  MPXV7002DP  [MPXV7002DP-Footprint-1]
J5  76342-303LF  [AMPHENOL_76342-303LF]
R17  value 0R  Package: 0402  [FP-RK73Z1E-IPC_B]  (hidden comment: RK73Z1ETTP)
R18  value 1.2k  Power: 100mW  Case/Package: 0402  [RESC1005X40X25LL10T10]  (hidden comment: RK73H1ETTP1201F)
R19  value 1.2k  Power: 100mW  Case/Package: 0402  [RESC1005X40X25LL10T10]  (hidden comment: RK73H1ETTP1201F)
R20  value 10kR  Package: 0402  Power Rating: 0.1W  [RESC1005X40X25LL10T10]  (hidden comment: RK73H1ETTP1002F)
R21  value 10kR  Package: 0402  Power Rating: 0.1W  [RESC1005X40X25LL10T10]  (hidden comment: RK73H1ETTP1002F)
R23  value 49.9R  [RESC1005X40X25LL10T10]  (hidden comment: RK73H1ETTP49R9F)
R24  value 0.22Ω  [RESC1608X55X30NL15T15]  (hidden comment: ERJ-3RQFR22V)
R25  value 0.47Ω  [RESC1608X55X30ML15T15]  (hidden comment: ERJ-3RQFR47V)
R26  value 49.9R  [RESC1005X40X25LL10T10]  (hidden comment: RK73H1ETTP49R9F)
R27  value 49.9R  [RESC1005X40X25LL10T10]  (hidden comment: RK73H1ETTP49R9F)
R28  value 49.9R  [RESC1005X40X25LL10T10]  (hidden comment: RK73H1ETTP49R9F)
R29  value 49.9R  [RESC1005X40X25LL10T10]  (hidden comment: RK73H1ETTP49R9F)
R30  value 10kR  Package: 0402  Power Rating: 0.1W  [RESC1005X40X25LL10T10]  (hidden comment: RK73H1ETTP1002F)
U6  THS4281DBVR  [DBV0005A_L]  (value not drawn)
U7  ADS8699IPWR  [TSOP65P640X120-16N]

### Ports
5V (in), 10V (in), 48V (in), DP_Fan (out), GND (bidir), RSTn_ADS (bidir), SPI1_CS1 (bidir), SPI1_MISO (out), SPI1_MOSI (in), SPI1_SCLK (bidir)

### Nets
5V: C19.2 C22.1 C23.1 FB2.1 IC1.2(Vs) J5.04 R20.2 R21.2 U6.5(VS+) U7.16(DVDD) ; port 5V
10V: J5.02 ; port 10V
48V: J5.06 ; port 48V  [project net 24V]
GND: C19.1 C20.2 C22.2 C23.2 C24.2 C25.2 C26.2 C27.2 IC1.3(GND) J5.05 R19.1 R30.1 U6.2(VS-) U7.1(DGND) U7.3(AGND) U7.5(REFGND) ; port GND
~{C}S: R28.1 ; port SPI1_CS1
AINN_1: C21.1 R19.2 U7.8(AIN_N)
AINP_1: C21.2 R18.2 U7.7(AIN_P)
DP_Fan: J5.03 ; port DP_Fan
INT17a: R23.1 ; port RSTn_ADS
MISO: R26.1 ; port SPI1_MISO
MOSI: R29.1 ; port SPI1_MOSI
MPX_OUT: J5.01 R18.1 U6.1(VOUT) U6.4(IN-)
REFIO_1: R25.2 U7.4(REFIO)
SCLK: R27.1 ; port SPI1_SCLK
NetC20_1: C20.1 R17.2 U6.3(IN+)
NetC24_1: C24.1 FB2.2 U7.2(AVDD)
NetC25_1: C25.1 C26.1 R24.2
NetC27_1: C27.1 R25.1
NetIC1_4: IC1.4(Vo) R17.1
NetR20_1: R20.1 R26.2 U7.13(SDO)
NetR21_1: R21.1 R23.2 U7.9(~{RST})
NetR24_1: R24.1 U7.6(REFCAP)
NetR27_2: R27.2 U7.12(SCLK)
NetR28_2: R28.2 U7.11(~{CS})
NetR29_2: R29.2 U7.10(SDI)
NetR30_2: R30.2 U7.14(ALARM)

Not connected (* = marked no-connect by the designer): IC1 1(NC)* 5(NC)* 6(NC)* 7(NC)* 8(NC)*; U7 15(RVS)*

### Notes on the sheet
- Title:
- Date:
- Drawn By:
- Time:
- Checked By:
- File:
- Sheet
- of

### Library data of the parts
C19 C22 = CMP-001-00333-1: as C3-C5 on sheet MCU; Max Operating Temperature: 125°C; RoHS Compliant: Yes; Capacitor Type: Ceramic; Min Operating Temperature: -55°C; Pins: 2; Mounting Technology: Surface Mount
C20 = CMP-2006-03022-3: CAP CER 1000PF 50V X7R 0603; Manufacturer: KEMET; Automotive Grade: Grade 1; Tolerance: 0.1; Capacitance: 1,000 pF; Temperature Coefficient: 30ppm/°C; Material: Ceramic; Temperature Characteristic: X7R; ComponentLink2URL: https://api.kemet.com/component-edge/download/datasheet/C0603C100J5GACAUTO.pdf; Temperature Range Low: -55°C; Device Class L2: Capacitors; Device Class L3: Ceramic Capacitors; Device Class L1: Passive Components; Temperature Range High: +125°C; Manufacturer Part Number: C0603C102K5RACTU; Digikey Description: CAP CER 1000PF 50V X7R 0603; Temperature: -55°C to +125°C; Mouser Description: Capacitor; Ceramic; Cap; 1000pF; Tol 10%; SMT; Vol-Rtg 50V; X7R; Tape and Reel; Automotive: Yes; RoHS: TRUE; Octopart: https://octopart.com/c0603c102k5ractu-kemet-144878; Height: 0.87mm; Lead Free: Yes; Category: Cap; ComponentLink2Description: Datasheet
C21 = CMP-x00072-1: as C2 on sheet MCU; Mounting: SMT; MOQ: 10000; Category: Capacitor; Price: 0.00352
C23-C25 = CMP-001-00329-1: as C1 on sheet MCU; Capacitor Type: Ceramic; Min Operating Temperature: -25°C; RoHS Compliant: Yes; Max Operating Temperature: 85°C; Pins: 2; Mounting Technology: Surface Mount
C26 = CMP-06035-026322-1: Chip Multilayer Ceramic Capacitors for General Purpose, 0805, 22uF, X5R, 15%, 20%, 16V; Height: 1.25mm; Thickness: 0.057inch; Min Operating Temperature: -55°C; Tolerance: 20%; Package Quantity: 3000; Packaging: Tape and Reel; Case/Package: 0805; Voltage Rating: 16V; Dielectric: X5R; Max Operating Temperature: 85°C; Case Code (Metric): 2012; Depth: 1.25mm; Lead Free: Lead Free; Termination: SMD/SMT; Case Code (Imperial): 0805; Voltage Rating (DC): 16V; Length: 2mm; Weight: 0.000335oz; Width: 0.049inch; Mount: Surface Mount
C27 = CMP-13271-000854-1: as C64 on sheet ModBus; Tolerance: 10%; Package Quantity: 1; Case/Package: 0805; Length: 0.079inch; Mount: Surface Mount; Thickness: 0.053inch; Width: 0.049inch; Voltage Rating: 25V; Min Operating Temperature: -55°C; Packaging: Cut Tape; Lead Free: Lead Free; Max Operating Temperature: 85°C; Case Code (Metric): 2012; Case Code (Imperial): 0805
FB2 = CMP-006-00035-1: Ferrite Chip, 1 Function(s), 2.2A, 2 Pin(s); Vendor: TTI; Reel Size: 8mm; MOQ: 4000; Package: 0603; Mounting: SMT; Rating: 2.2A; Category: Ferrite Bead; Price: 0.0219
IC1 = CMP-010-00029-6: Manufacturer: NXP; Reel Width: Tray; Vendor: Mouser; Template: NXP_SOP_8; Mounting: SMT; Package: SOP-8; Category: IC; Price: 23.85; MOQ: 1
J5 = CMP-035-000000-1: Dubox, Board To Board Connector, Receptacle, Vertical, Through Hole, Top Entry, Double Row , 6 Positions, 2.54mm (0.100in) Pitch; MF: Amphenol; Component Type: Standard; Design Item ID: 76342-303LF; Pin Count: 6; MP: 76342-303LF; Source: 76342-303LF.SchLib; SnapEDA_Link: https://www.snapeda.com/parts/76342-303LF/Amphenol/view-part/?ref=snap; Value: *; Check_prices: https://www.snapeda.com/parts/76342-303LF/Amphenol/view-part/?ref=eda; Package: None
R17 = CMP-x00147-2: as R11-R13 on sheet MCU
R18 R19 = CMP-009-01022-2: Fixed Resistor, Metal Glaze/thick Film, 0.1W, 1200ohm, 75V, 1% +/-Tol, 100ppm/Cel, Surface Mount, 0402; RoHS Compliant: Yes; Max Operating Temperature: 155°C; Min Operating Temperature: -55°C; Tolerance: 1%; Pins: 2; Mounting Technology: Surface Mount
R20 R21 R30 = CMP-x00150-2: as R2-R8 on sheet MCU
R23 R26-R29 = CMP-x00154-2: Fixed Resistor, Metal Glaze/thick Film, 0.1W, 49.9ohm, 75V, 1% +/-Tol, 100ppm/Cel, Surface Mount, 0402; Template: KS_0402_R; Package: 0402
R24 = CMP-2000-00853-1: Manufacturer: Panasonic; Part Number: ERJ-3RQFR22V
R25 = CMP-2000-00857-1: Manufacturer: Panasonic; Part Number: ERJ-3RQFR47V
U6 = CMP-0018-00449-2: Very Low-Power High Speed Rail-to-Rail Input / Output Voltage Feedback Operational Amplifier, 2.7 to 16.5 V, -40 to 85 degC, 5-pin SOT23 (DBV5), Green (RoHS & no Sb/Br); Manufacturer: Texas Instruments; Settling Time (0.1%)(Typ)(ns): 78; Io(Typ)(mA): 30; Vs(Min)(V): 2.7; Acl, min stable gain(V/V): 1; THD (Fc is 1 MHz)(Typ)(dB): -67; Rail-Rail: In, Out; Sub Family: High Speed Amplifier (>=50MHz), Low Supply Voltage Amplifier (<=2.7V); Diff Phase(deg): 0.11; Slew Rate(Typ)(V/us): 35; Vn at Flatband(Typ)(nV/rtHz): 12.5; Vs(Max)(V): 16.5; 3rd Harmonic(dBc): 52; Vio(Max)(mV): 3.5; BW @ Acl(MHz): 90; Iib(Max)(nA): 1000; ComponentLink2URL: http://www.ti.com/general/docs/lit/getliterature.tsp?genericPartNumber=THS4281&fileType=pdf; ComponentLink1URL: http://www.ti.com/; PackageReference: DBV0005A; DatasheetVersion: SLOS432A; PartNumber: THS4281DBVR; ComponentLink1Description: Manufacturer URL; Mounting Technology: Surface Mount; Number of Channels: 1; Iq per channel(Max)(mA): 1; Diff Gain(%): 0.11; Code_JEDEC: MO-178; ComponentLink2Description: Datasheet; ComponentLink3URL: http://www.ti.com/litv/pdf/mpds018i; 2nd Harmonic(dBc): 52; ComponentLink3Description: Package Specification; PackageVersion: 4073253-4/K, 03/2006; Eco-Plan: Green (RoHS & no Sb/Br); PackageDescription: 5-Pin Plastic Small Outline, Body 1.6 x 2.9 mm, Pitch 0.95 mm; @ MHz: 1
U7 = CMP-001-0096-1: ADC, Successive Approximation, 18-Bit, 1 Func, 1 Channel, Serial Access, PDSO16

## Sheet Louver Control.SchDoc
size A4; SheetNumber: 9; SheetTotal: 9
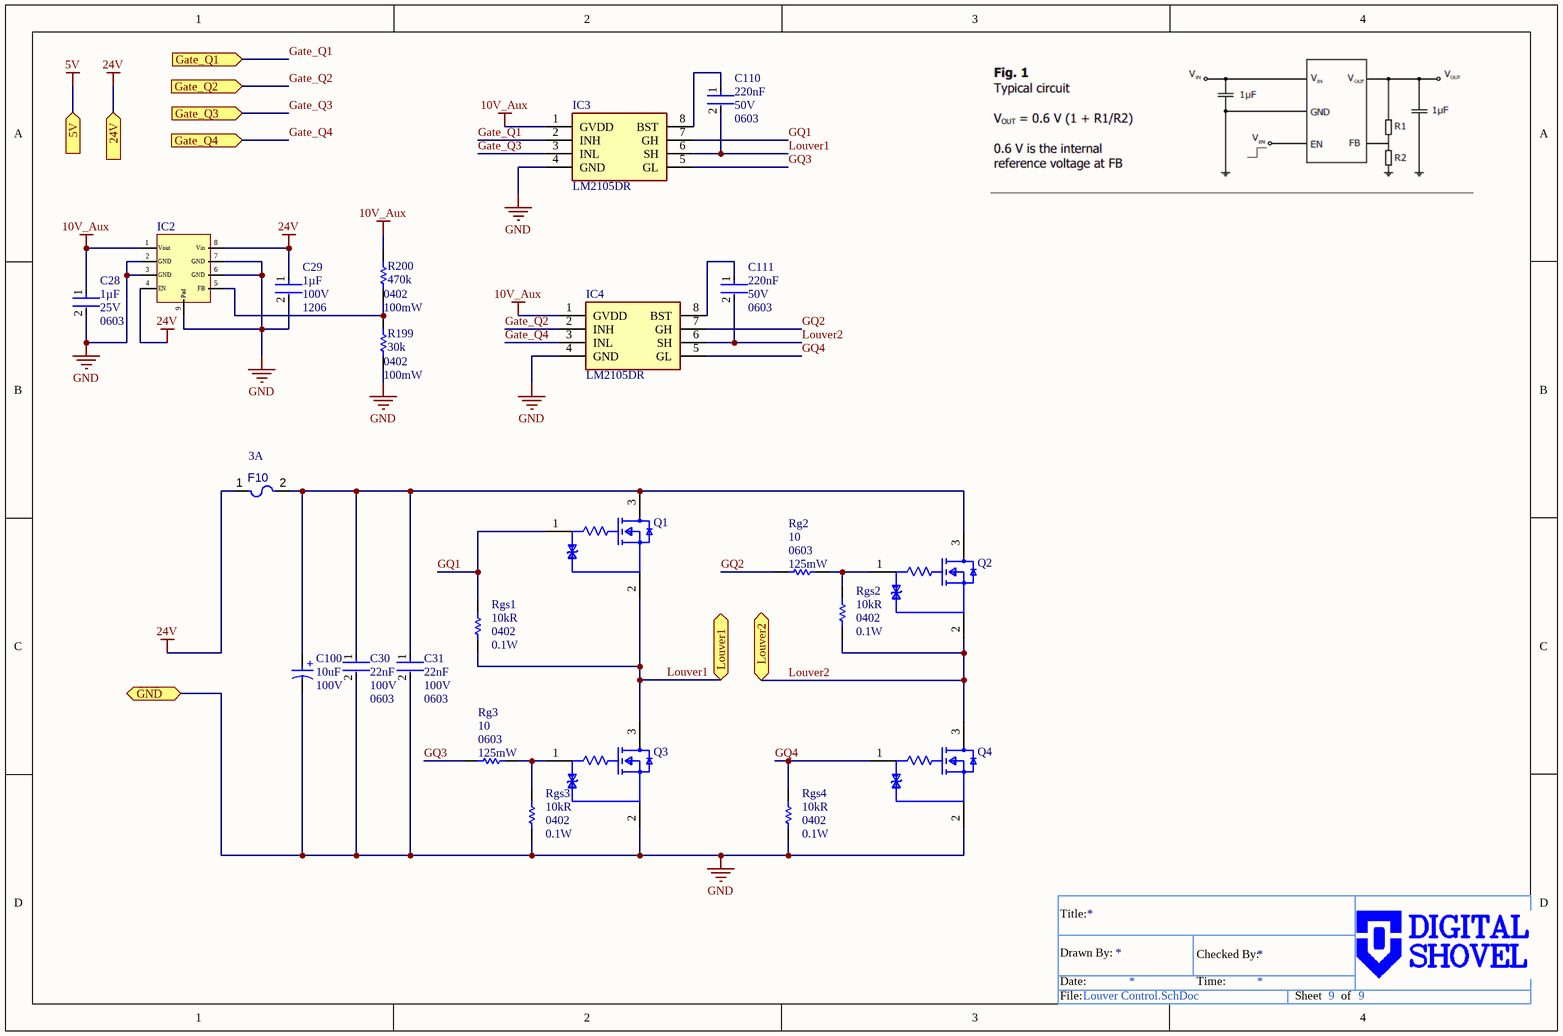
[diagram p10: Louver Control.SchDoc]

### Parts
C28  value 1µF  Voltage Rating: 25V  Case/Package: 0603  [FP-CL10-IPC_A]  (hidden comment: CL10B105KA8NNNC)
C29  value 1µF  Voltage Rating: 100V  Case/Package: 1206  [FP-CL31-IPC_A]  (hidden comment: CL31B105KCHSNNE)
C30  value 22nF  Voltage Rating: 100V  Case/Package: 0603  [FP-C0603C-CF-IPC_A]  (hidden comment: C0603C223K1RACAUTO)
C31  value 22nF  Voltage Rating: 100V  Case/Package: 0603  [FP-C0603C-CF-IPC_A]  (hidden comment: C0603C223K1RACAUTO)
C100  value 10uF  Voltage Rating: 100V  [WCAP-ASLL_D6.3H7.7]  (hidden comment: 865060845002)
C110  value 220nF  Voltage Rating: 50V  Case/Package: 0603  [FP-CL10-IPC_A]  (hidden comment: CL10B224KB8VPNC)
C111  value 220nF  Voltage Rating: 50V  Case/Package: 0603  [FP-CL10-IPC_A]  (hidden comment: CL10B224KB8VPNC)
F10  Current Rating: 3A  [0679H3000-05-Footprint-1]  (hidden comment: 0679H3000-05)
IC2  LDI55-ADEEN  [LDI55-ADEEN-Footprint-1]  (value not drawn)
IC3  LM2105DR  [LM2105DR-Footprint-1]
IC4  LM2105DR  [LM2105DR-Footprint-1]
Q1  SSM3K361R,LF  [FP-2-3Z1S-MFG]  (value not drawn)
Q2  SSM3K361R,LF  [FP-2-3Z1S-MFG]  (value not drawn)
Q3  SSM3K361R,LF  [FP-2-3Z1S-MFG]  (value not drawn)
Q4  SSM3K361R,LF  [FP-2-3Z1S-MFG]  (value not drawn)
R199  value 30k  Power: 100mW  Case/Package: 0402  [RESC1005X40X25LL10T10]  (hidden comment: RK73H1ETTP3002F)
R200  value 470k  Case/Package: 0402  Power: 100mW  [RESC1005X40X25LL10T10]  (hidden comment: RK73H1ETTP4703F)
Rg2  value 10  Case/Package: 0603  Power: 125mW  [FP-RK73H1J-IPC_A]  (hidden comment: RK73H1JTTDD10R0F)
Rg3  value 10  Case/Package: 0603  Power: 125mW  [FP-RK73H1J-IPC_A]  (hidden comment: RK73H1JTTDD10R0F)
Rgs1  value 10kR  Package: 0402  Power Rating: 0.1W  [RESC1005X40X25LL10T10]  (hidden comment: RK73H1ETTP1002F)
Rgs2  value 10kR  Package: 0402  Power Rating: 0.1W  [RESC1005X40X25LL10T10]  (hidden comment: RK73H1ETTP1002F)
Rgs3  value 10kR  Package: 0402  Power Rating: 0.1W  [RESC1005X40X25LL10T10]  (hidden comment: RK73H1ETTP1002F)
Rgs4  value 10kR  Package: 0402  Power Rating: 0.1W  [RESC1005X40X25LL10T10]  (hidden comment: RK73H1ETTP1002F)

### Ports
5V (in), 24V (in), Gate_Q1 (in), Gate_Q2 (in), Gate_Q3 (in), Gate_Q4 (in), GND (bidir), Louver1 (bidir), Louver2 (bidir)

### Nets
10V_Aux: C28.1 IC2.1(Vout) IC3.1(GVDD) IC4.1(GVDD) R200.2
24V: C29.1 F10.1 IC2.4(EN) IC2.8(Vin) ; port 24V
GND: C28.2 C29.2 C30.2 C31.2 C100.2(N) IC2.2(GND) IC2.3(GND) IC2.6(GND) IC2.7(GND) IC2.9(Pad) IC3.4(GND) IC4.4(GND) Q3.2(Source) Q4.2(Source) R199.1 Rgs3.1 Rgs4.1 ; port GND
Gate_Q1: IC3.2(INH) ; port Gate_Q1
Gate_Q2: IC4.2(INH) ; port Gate_Q2
Gate_Q3: IC3.3(INL) ; port Gate_Q3
Gate_Q4: IC4.3(INL) ; port Gate_Q4
GQ1: IC3.7(GH) Q1.1(Gate) Rgs1.2
GQ2: IC4.7(GH) Rg2.1
GQ3: IC3.5(GL) Rg3.1
GQ4: IC4.5(GL) Q4.1(Gate) Rgs4.2
Louver1: C110.2 IC3.6(SH) Q1.2(Source) Q3.3(Drain) Rgs1.1 ; port Louver1
Louver2: C111.2 IC4.6(SH) Q2.2(Source) Q4.3(Drain) Rgs2.1 ; port Louver2
NetC30_1: C30.1 C31.1 C100.1(P) F10.2 Q1.3(Drain) Q2.3(Drain)
NetC110_1: C110.1 IC3.8(BST)
NetC111_1: C111.1 IC4.8(BST)
NetIC2_5: IC2.5(FB) R199.2 R200.1
NetQ2_1: Q2.1(Gate) Rg2.2 Rgs2.2
NetQ3_1: Q3.1(Gate) Rg3.2 Rgs3.2

### Notes on the sheet
- Title:
- Date:
- Drawn By:
- Time:
- Checked By:
- File:
- Sheet
- of
- (in symbol CMP-001-00357-1) +

### Library data of the parts
C28 = CMP-001-00231-4: Ceramic Capacitor, Multilayer, Ceramic, 25V, 10% +Tol, 10% -Tol, X7R, 15% TC, 1uF, Surface Mount, 0603; Template: SS_0603_C; Pins: 2; Capacitor Type: Ceramic; RoHS Compliant: Yes; Max Operating Temperature: 125°C; Mounting Technology: Surface Mount; Min Operating Temperature: -55°C
C29 = CMP-001-00354-1: Ceramic Capacitor, Multilayer, Ceramic, 100V, 10% +Tol, 10% -Tol, X7R, 15% TC, 1uF, Surface Mount, 1206; Capacitor Type: Ceramic; RoHS Compliant: Yes; Min Operating Temperature: -55°C; Max Operating Temperature: 125°C; Mounting Technology: Surface Mount; Pins: 2
C30 C31 = CMP-001-00355-1: Ceramic Capacitor, Ceramic, 100V, 10% +Tol, 10% -Tol, X7R, 15% TC, 0.022uF, Surface Mount, 0603; RoHS Compliant: Yes; Min Operating Temperature: -55°C; Mounting Technology: Surface Mount; Max Operating Temperature: 125°C; Pins: 2; Capacitor Type: Ceramic
C100 = CMP-001-00357-1: Cap, 10Uf, 100V, Alu Elec, Smd, Radial Rohs Compliant: Yes
C110 C111 = CMP-001-00356-1: Ceramic Capacitor, Multilayer, Ceramic, 50V, 10% +Tol, 10% -Tol, X7R, 15% TC, 0.22uF, Surface Mount, 0603; Mounting Technology: Surface Mount; Max Operating Temperature: 125°C; Capacitor Type: Ceramic; Pins: 2; Min Operating Temperature: -55°C; RoHS Compliant: Yes
F10 = CMP-005-00026-1: Electric Fuse, Very Fast Blow, 3A, 350VAC, 72VDC, 50A (IR), Surface Mount, 2410; Min Operating Temperature: -55°C; RoHS Compliant: Yes; Max Operating Temperature: 125°C
IC2 = CMP-031-00039-3: Linear Voltage Regulator IC Positive Adjustable 1 Output 1A 8-ESOP
IC3 IC4 = CMP-031-00040-1: 107-V 0.5-A/0.8-A half-bridge gate driver with 5-V UVLO and integrated bootstrap diode 8-SOIC -40 to 125
Q1-Q4 = CMP-031-00038-1: N-Channel 100 V 3.5A (Ta) 1.2W (Ta) Surface Mount SOT-23F
R199 = CMP-009-01041-1: Fixed Resistor, Metal Glaze/thick Film, 0.1W, 30000ohm, 75V, 1% +/-Tol, 100ppm/Cel, Surface Mount, 0402; Pins: 2; Tolerance: 1%; Mounting Technology: Surface Mount; RoHS Compliant: Yes; Min Operating Temperature: -55°C; Max Operating Temperature: 155°C
R200 = CMP-009-01042-1: Fixed Resistor, Metal Glaze/thick Film, 0.1W, 470000ohm, 75V, 1% +/-Tol, 100ppm/Cel, Surface Mount, 0402; Tolerance: 1%; Min Operating Temperature: -55°C; Mounting Technology: Surface Mount; Max Operating Temperature: 155°C; Pins: 2; RoHS Compliant: Yes
Rg2 Rg3 = CMP-009-01040-1: Fixed Resistor, Metal Glaze/thick Film, 0.125W, 10ohm, 75V, 1% +/-Tol, 100ppm/Cel, Surface Mount, 0603; Max Operating Temperature: 155°C; Pins: 2; RoHS Compliant: Yes; Mounting Technology: Surface Mount; Min Operating Temperature: -55°C; Tolerance: 1%
Rgs1-Rgs4 = CMP-x00150-2: as R2-R8 on sheet MCU